# EasyEDA Pro project py32f002.eprj

# Schematic PY32F002ASOP20V1
Create Date: 2024-02-05; Page Name: P1; Project Name: py32f002; Schematic Name: PY32F002ASOP20V1; Update Date: 2024-05-11; Company: 嘉立创EDA; Page Size: A4; Version: V1.0
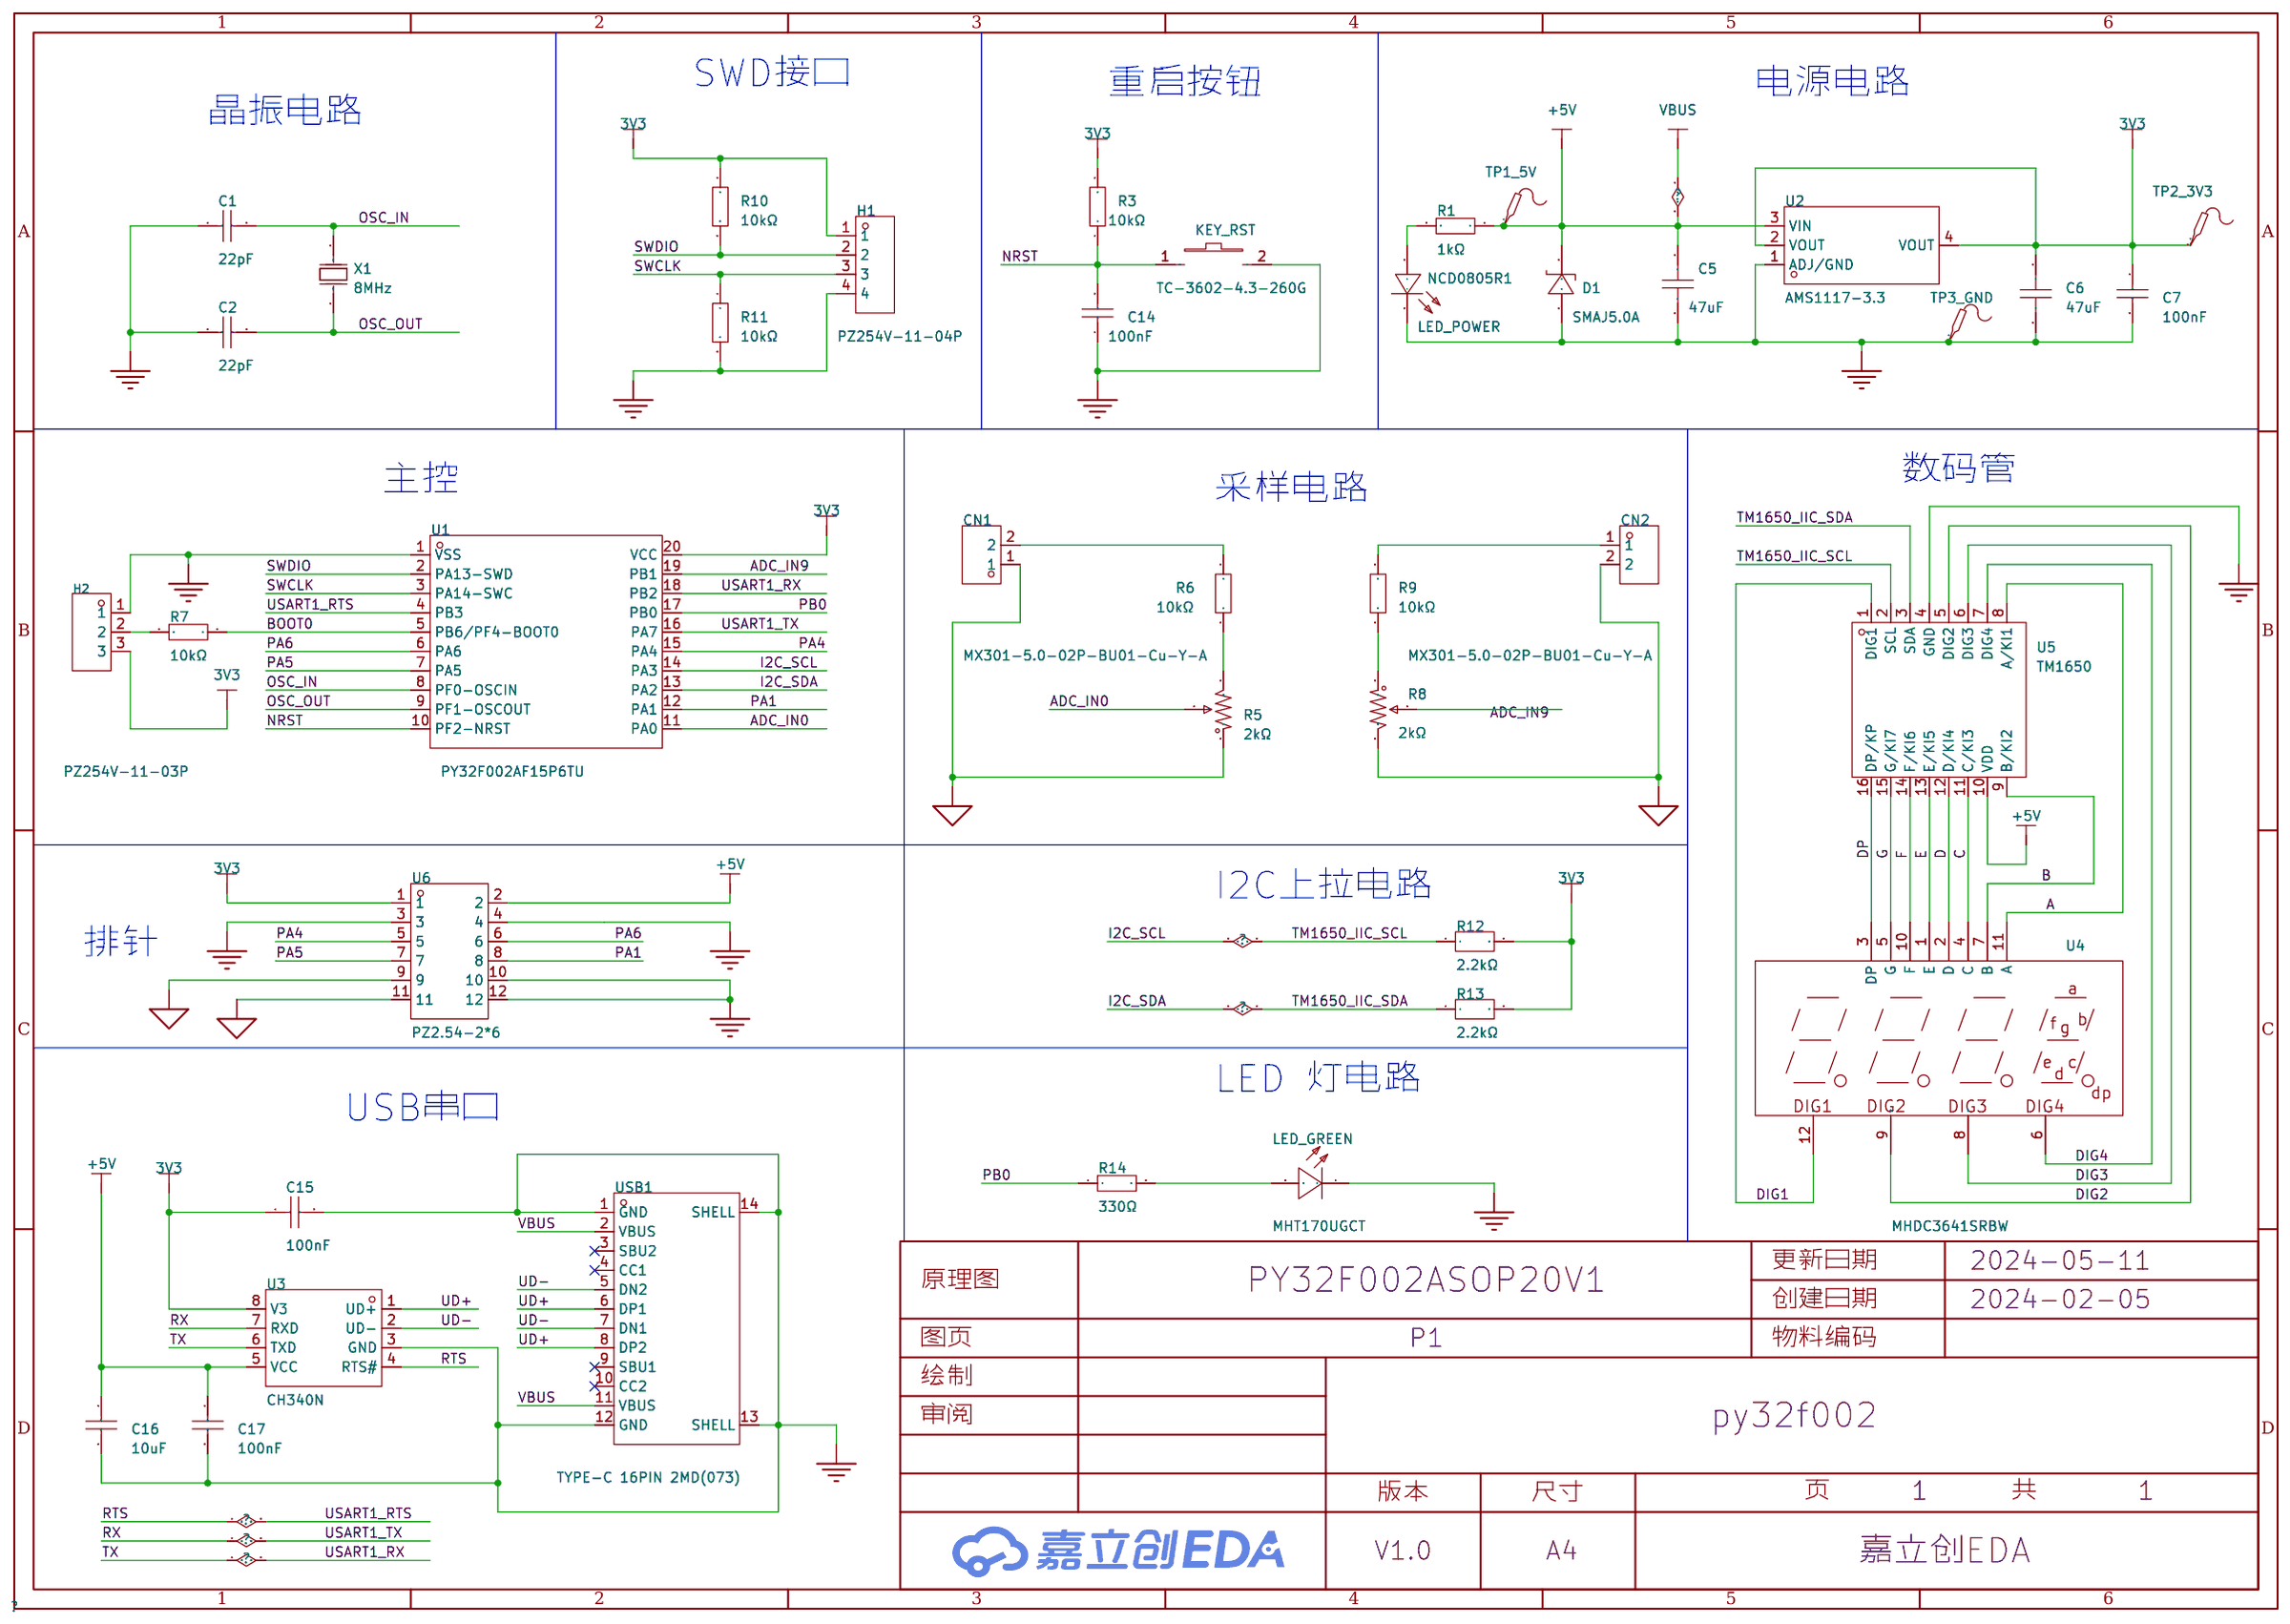
[diagram p0: schematic sheet]

## Parts
C1  22pF  [C0603]
C2  22pF  [C0603]
C5  47uF  [C1206]
C6  47uF  [C1206]
C7  100nF  [C1206]
C14  100nF  [C0603]
C15  100nF  [C1206]
C16  10uF  [C1206]
C17  100nF  [C1206]
CN1  MX301-5.0-02P-BU01-Cu-Y-A  [CONN-TH_2P-P5.0-MX301-5.0-02P-BU01-CU-Y-A]
CN2  MX301-5.0-02P-BU01-Cu-Y-A  [CONN-TH_2P-P5.0-MX301-5.0-02P-BU01-CU-Y-A]
D1  SMAJ5.0A  [SMA_L4.3-W2.6-LS5.2-RD]
H1  PZ254V-11-04P  [HDR-TH_4P-P2.54-V-M]
H2  PZ254V-11-03P  [HDR-TH_3P-P2.54-V-M]
KEY_RST  TC-3602-4.3-260G  [KEY-SMD_L6.0-W3.6-LS8.3-L]
LED_GREEN  MHT170UGCT  [LED0805-RD]
LED_POWER  NCD0805R1  [LED0805-R-RD]
R1  1kΩ  [R0603]
R3  10kΩ  [R0603]
R5  2kΩ  [RES-ADJ-SMD_3P-L3.8-W3.6_TC33X-2-502E]
R6  10kΩ  [R0603]
R7  10kΩ  [R0603]
R8  2kΩ  [RES-ADJ-SMD_3P-L3.8-W3.6_TC33X-2-502E]
R9  10kΩ  [R0603]
R10  10kΩ  [R0603]
R11  10kΩ  [R0603]
R12  2.2kΩ  [R0603]
R13  2.2kΩ  [R0603]
R14  330Ω  [R0603]
TP1_5V  -  [Test-Point-0.5mm]
TP2_3V3  -  [Test-Point-0.5mm]
TP3_GND  -  [Test-Point-0.5mm]
U1  PY32F002AF15P6TU  [TSSOP-20_L6.5-W4.4-P0.65-LS6.4-BL]
U2  AMS1117-3.3  [SOT-223_L6.5-W3.5-P2.30-LS7.0-BR]
U3  CH340N  [SOP-8_L4.9-W3.9-P1.27-LS6.0-BL]
U4  MHDC3641SRBW  [LED-SEG-TH_12P-L30.0-W14.0-P2.54-LS10.2]
U5  TM1650  [SOP-16_L10.0-W3.9-P1.27-LS6.0-BL]
U6  PZ2.54-2*6  [HDR-TH_12P-P2.54-V-M-R2-C6-S2.54_MOLEX]
USB1  TYPE-C 16PIN 2MD(073)  [USB-C-SMD_TYPE-C-6PIN-2MD-073]
X1  8MHz  [CRYSTAL-SMD_L11.5-W4.8-LS12.7]

## Library data of the parts
C1 C2 = CL10C220JB8NNNC: 容值:22pF;精度:±5%;额定电压:50V;材质(温度系数):C0G;; LCSC Part Name: 22pF ±5% 50V; Supplier Part: C1653; Manufacturer: SAMSUNG(三星); Supplier Footprint: 0603; JLCPCB Part Class: 基础库; Datasheet: https://atta.szlcsc.com/upload/public/pdf/source/20160218/1457707763339.pdf; Supplier: LCSC; Tolerance: ±5%; Voltage Rated: 50V; Temperature Coefficient: C0G
C5 C6 = GRM31CR61E476ME44L: 容值:47uF;精度:±20%;额定电压:25V;材质(温度系数):X5R;; LCSC Part Name: 47uF ±20% 25V; Supplier Part: C403725; Manufacturer: muRata(村田); Supplier Footprint: 1206; JLCPCB Part Class: 扩展库; Datasheet: https://atta.szlcsc.com/upload/public/pdf/source/20191025/C403725_B8A8CD2FFA1F57E6FDF268BD106459D5.pdf; Supplier: LCSC; Tolerance: ±20%; Voltage Rated: 25V; Temperature Coefficient: X5R
C7 C15 C17 = CL31B104KBCNNNC: 容值:100nF;精度:±10%;额定电压:50V;材质(温度系数):X7R;; LCSC Part Name: 100nF ±10% 50V; Supplier Part: C24497; Manufacturer: SAMSUNG(三星); Supplier Footprint: 1206; JLCPCB Part Class: 基础库; Datasheet: https://atta.szlcsc.com/upload/public/pdf/source/20160218/1457707763339.pdf; Supplier: LCSC; Tolerance: ±10%; Voltage Rated: 50V; Temperature Coefficient: X7R
C14 = 0603B104K500NT: 容值:100nF;精度:±10%;额定电压:50V;材质(温度系数):X7R;; LCSC Part Name: 100nF ±10% 50V; Supplier Part: C30926; Manufacturer: FH(风华); Supplier Footprint: 0603; JLCPCB Part Class: 扩展库; Datasheet: https://atta.szlcsc.com/upload/public/pdf/source/20200305/C486355_26A10D38EF8C2A5C37091D0039909270.pdf; Supplier: LCSC; Tolerance: ±10%; Voltage Rated: 50V; Temperature Coefficient: X7R
C16 = CL31A106KBHNNNE: 容值:10uF;精度:±10%;额定电压:50V;材质(温度系数):X5R;; LCSC Part Name: 10uF ±10% 50V; Supplier Part: C13585; Manufacturer: SAMSUNG(三星); Supplier Footprint: 1206; JLCPCB Part Class: 基础库; Datasheet: https://atta.szlcsc.com/upload/public/pdf/source/20160218/1457707763339.pdf; Supplier: LCSC; Tolerance: ±10%; Voltage Rated: 50V; Temperature Coefficient: X5R
CN1 CN2 = MX301-5.0-02P-BU01-Cu-Y-A: 结构:1x2P;间距:5mm;颜色:蓝色;安装方式:直插;额定电流:16A;额定电压:300V;排数:1;线规 - AWG:14~24;线规 - 平方毫米:1.5;每排PIN数:2;触头材质:铜合金;触头镀层:锡;工作温度范围:-40℃~+105℃;; LCSC Part Name: 5mm 1x2P 排数:1 每排P数:2 直插; Supplier Part: C5188422; Manufacturer: MAX(迈旭); Supplier Footprint: 插件,P=5mm; JLCPCB Part Class: Extended Part; Datasheet: https://atta.szlcsc.com/upload/public/pdf/source/20230915/1F0A484E8C4B07E7C9BE20D191F8A304.pdf; Supplier: LCSC; Structure: 1x2P; Pitch: 5mm; Color: 蓝色; Mounting Style: 直插; Current Rating (Max): 16A; Voltage Rating (Max): 300V; Number of Pins: 2P; Number of Rows: 1; Wire Gauge - AWG: 14~24; Wire Gauge - mm2: 1.5; Number of PINs Per Row: 2; Contact Material: 铜合金; Contact Plating: 锡; Operating Temperature Range: -40℃~+105℃
D1 = SMAJ5.0A_C10758: 反向截止电压(Vrwm):5V;最大钳位电压:9.2V;峰值脉冲电流(Ipp)@10/1000us:43.5A;击穿电压:6.4V;; LCSC Part Name: 单向TVS 5V截止 43.5A峰值脉冲; Supplier Part: C10758; Manufacturer: RUILON(瑞隆源); Supplier Footprint: SMA(DO-214AC); JLCPCB Part Class: 扩展库; Datasheet: https://atta.szlcsc.com/upload/public/pdf/source/20180711/C81281_95CC36DD15828E233F5FA92369DBC9C5.pdf; Supplier: LCSC; Reverse Stand-Off Voltage (Vrwm): 5V; Maximum Clamping Voltage: 9.2V; Peak Pulse Current (Ipp)@10/1000us: 43.5A; Breakdown Voltage: 6.4V; Type: TVS
H1 = PZ254V-11-04P: 插针结构:1x4P;间距:2.54mm;行距:-;圆针/方针:方针;安装类型:直插;排数:单排;总PIN位数:4P;额定电流:3A;额定电压:250V;配合针长度:6mm;塑高:2.5mm;端接针长度:3mm;触头材质:-;工作温度范围:-40℃~+105℃;颜色:黑色;; LCSC Part Name: 间距:2.54mm 1x4P 直插 方针; Supplier Part: C2691448; Manufacturer: XFCN(兴飞); Supplier Footprint: 插件,P=2.54mm; JLCPCB Part Class: 扩展库; Datasheet: https://atta.szlcsc.com/upload/public/pdf/source/20200309/C492403_F9F19131791D08044AD4F84F8E751A34.pdf; Supplier: LCSC; Pin Structure: 1x4P; Pitch: 2.54mm; Circluar Pins/Square Pins: 方针; Mounting Type: 直插; Number of Rows: 单排; Number of Pins: 4P; Current Rating (Max): 3A; Voltage Rating (Max): 250V; Length of Mating Pin: 6mm; Insulation Height: 2.5mm; Length of End Connection Pin: 3mm; Operating Temperature Range: -40℃~+105℃; Color: 黑色
H2 = PZ254V-11-03P: 插针结构:1x3P;间距:2.54mm;行距:-;圆针/方针:方针;安装类型:直插;排数:单排;总PIN位数:3P;额定电流:3A;额定电压:250V;配合针长度:6mm;塑高:2.5mm;端接针长度:3mm;工作温度范围:-40℃~+105℃;颜色:黑色;; LCSC Part Name: 间距:2.54mm 1x3P 直插 方针; Supplier Part: C2937625; Manufacturer: XFCN(兴飞); Supplier Footprint: 插件,P=2.54mm; JLCPCB Part Class: 扩展库; Datasheet: https://atta.szlcsc.com/upload/public/pdf/source/20200309/C492402_8335C3D49C4E4C618838D59BB1D024C1.pdf; Supplier: LCSC; Pin Structure: 1x3P; Pitch: 2.54mm; Circluar Pins/Square Pins: 方针; Mounting Type: 直插; Number of Rows: 单排; Number of Pins: 3P; Current Rating (Max): 3A; Voltage Rating (Max): 250V; Length of Mating Pin: 6mm; Insulation Height: 2.5mm; Length of End Connection Pin: 3mm; Operating Temperature Range: -40℃~+105℃; Color: 黑色
KEY_RST = TC-3602-4.3-260G_C3012022: 电路结构:单刀单掷;带支架:否;触点电流:50mA;额定电压(AC):-;额定电压(DC):12V;额定功率:-;安装方式:立贴;绝缘电阻:-;带灯:无;作用力:260gf;机械寿命:10万次;; LCSC Part Name: 3*6*4.3mm 立贴 轻触开关; Supplier Part: C3012022; Manufacturer: HCTL(华灿天禄); Supplier Footprint: SMD; JLCPCB Part Class: 扩展库; Datasheet: https://atta.szlcsc.com/upload/public/pdf/source/20210730/C2845293_5277CDF8C59032B794BE536E6FDEACDD.pdf; Supplier: LCSC; Circuit: 单刀单掷; Actuator Style: 圆形按钮; Switch Length: 3mm; Switch Width: 6mm; Switch Height: 4.3mm; Strike Gundam: 否; Contact Current: 50mA; Voltage Rating (DC): 12V; Mounting Style: 立贴; Actuator/Cap Color: 白色; With Lamp: 无; Operating Force: 260gf; Mechanical Life: 10万次; Operating Temperature: -30℃~+85℃
LED_GREEN = MHT170UGCT: 发光颜色:翠绿色;功率:95mW;正向电流:20mA;主波长:517.5nm~527.5nm;二极管配置:-;透镜颜色:无色透明透镜;色温:-;发光角度:140°;载带方式:-;工作温度:-40℃~+85℃;; LCSC Part Name: 翠绿; Supplier Part: C397047; Manufacturer: MEIHUA(美华); Supplier Footprint: 0805; JLCPCB Part Class: 扩展库; Datasheet: https://atta.szlcsc.com/upload/public/pdf/source/20190613/C397047_2A22FA6439BE28969F43FCCFADF75FF7.pdf; Supplier: LCSC; Emitted Color: 翠绿色; Power Dissipation: 95mW; Forward Current: 20mA; Dominant Wavelength: 517.5nm~527.5nm; Peak Wavelength: 518nm; Lens Color: 无色透明透镜; Viewing Angle: 140°; Operating Temperature: -40℃~+85℃
LED_POWER = NCD0805R1: 灯头类型:-;发光颜色:红色;正向电压(VF):1.6V~2.6V;功率:65mW;正向电流:20mA;主波长:615nm~630nm;二极管配置:独立二极管;透镜颜色:无色透明;色温:-;发光强度:67mcd~195mcd;发光角度:130°;载带方式:-;工作温度:-30℃~+85℃;; Supplier Part: C84256; Manufacturer: 国星光电; Supplier Footprint: 0805; JLCPCB Part Class: 基础库; Datasheet: https://atta.szlcsc.com/upload/public/pdf/source/20200820/C84256_F0A75A43B3EAD75808600A0514C76B99.pdf; Supplier: LCSC; Emitted Color: 红色; Forward Voltage (VF): 1.6V~2.6V; Power Dissipation: 65mW; Forward Current: 20mA; Dominant Wavelength: 615nm~630nm; Diode Configuration: 独立二极管; Lens Color: 无色透明; Luminous Intensity: 67mcd~195mcd; Viewing Angle: 130°; Operating Temperature: -30℃~+85℃
R1 = RC0603FR-071KL: 电阻类型:厚膜电阻;阻值:1kΩ;精度:±1%;功率:100mW;; LCSC Part Name: 1kΩ ±1% 100mW; Supplier Part: C22548; Manufacturer: YAGEO(国巨); Supplier Footprint: 0603; JLCPCB Part Class: 扩展库; Datasheet: https://atta.szlcsc.com/upload/public/pdf/source/20180312/7BD3618A8B6324EA6280B0497A051AB7.pdf; Supplier: LCSC; Type: 厚膜电阻; Tolerance: ±1%; Power(Watts): 100mW; Temperature Coefficient: ±100ppm/℃; Overload Voltage (Max): 75V; Operating Temperature Range: -55℃~+155℃
R3 R6 R7 R9-R11 = 0603WAF1002T5E: 电阻类型:厚膜电阻;阻值:10kΩ;精度:±1%;功率:100mW;最大工作电压:75V;温度系数:±100ppm/℃;; LCSC Part Name: 10kΩ ±1% 100mW 厚膜电阻; Supplier Part: C25804; Manufacturer: UNI-ROYAL(厚声); Supplier Footprint: 0603; JLCPCB Part Class: 基础库; Datasheet: https://atta.szlcsc.com/upload/public/pdf/source/20200306/C422600_1E6D84923E4A46A82E41ADD87F860B5C.pdf; Supplier: LCSC; Type: 厚膜电阻; Tolerance: ±1%; Power(Watts): 100mW; Overload Voltage (Max): 75V; Temperature Coefficient: ±100ppm/℃; Operating Temperature Range: -55℃~+155℃
R5 R8 = TC33X-2-202E: 阻值:2kΩ;精度:±25%;功率:150mW;温度系数:±250ppm/℃;; LCSC Part Name: 2kΩ ±25%; Supplier Part: C720647; Manufacturer: BOURNS; Supplier Footprint: SMD; JLCPCB Part Class: 扩展库; Datasheet: https://atta.szlcsc.com/upload/public/pdf/source/20200810/C720646_BB66A75E654D5E1D30127FF45BCD3C26.pdf; Supplier: LCSC; Tolerance: ±25%; Power(Watts): 150mW; Temperature Coefficient: ±250ppm/℃; Turns: 1
R12 R13 = FRC0603J222 TS: 电阻类型:厚膜电阻;阻值:2.2kΩ;精度:±5%;功率:100mW;最大工作电压:75V;温度系数:±100ppm/℃;; LCSC Part Name: 2.2kΩ ±5% 100mW 厚膜电阻; Supplier Part: C2907117; Manufacturer: FOJAN(富捷); Supplier Footprint: 0603; JLCPCB Part Class: 扩展库; Datasheet: https://atta.szlcsc.com/upload/public/pdf/source/20211221/925EC7D7225764EE0046F22065062C87.pdf; Supplier: LCSC; Type: 厚膜电阻; Tolerance: ±5%; Power(Watts): 100mW; Overload Voltage (Max): 75V; Temperature Coefficient: ±100ppm/℃; Operating Temperature Range: -55℃~+155℃
R14 = 0603WAF3300T5E: 电阻类型:厚膜电阻;阻值:330Ω;精度:±1%;功率:100mW;最大工作电压:75V;温度系数:±100ppm/℃;; LCSC Part Name: 330Ω ±1% 100mW 厚膜电阻; Supplier Part: C23138; Manufacturer: UNI-ROYAL(厚声); Supplier Footprint: 0603; JLCPCB Part Class: 基础库; Datasheet: https://atta.szlcsc.com/upload/public/pdf/source/20200306/C422600_1E6D84923E4A46A82E41ADD87F860B5C.pdf; Supplier: LCSC; Type: 厚膜电阻; Tolerance: ±1%; Power(Watts): 100mW; Overload Voltage (Max): 75V; Temperature Coefficient: ±100ppm/℃; Operating Temperature Range: -55℃~+155℃
TP1_5V TP2_3V3 TP3_GND = Test-Point: Test Point 测试点
U1 = PY32F002AF15P6TU: 程序存储容量:20KB;RAM总容量:3KB;工作电压范围:1.7V~5.5V;CPU最大主频:24MHz;程序存储器类型:FLASH;; LCSC Part Name: 32位微控制器 单片机  PY32F002AF15P6TU; Supplier Part: C5292059; Manufacturer: PUYA(普冉); Supplier Footprint: TSSOP-20; JLCPCB Part Class: 扩展库; Datasheet: https://atta.szlcsc.com/upload/public/pdf/source/20230327/672347329C675A87241B0153A51AEBC2.pdf; Supplier: LCSC; Program Storage Size: 20KB; RAM Size: 3KB; Operating Voltage Range: 1.7V~5.5V; CPU Maximum Speed: 24MHz; Program Memory Type: FLASH; ADC (Bit): 12bit
U2 = AMS1117-3.3_C426566: 输出类型:固定;最大输入电压:18V;输出电压:3.3V;输出电流:1A;电源纹波抑制比(PSRR):70dB@(120Hz);输出极性:正;; LCSC Part Name: 输入18V 输出3.3V 1A; Supplier Part: C426566; Manufacturer: Slkor(萨科微); Supplier Footprint: SOT-223; JLCPCB Part Class: 扩展库; Datasheet: https://atta.szlcsc.com/upload/public/pdf/source/20201231/C426566_7F22DB93439D00F3FA27143E4F28C6AA.pdf; Supplier: LCSC; Output Type: 固定; Maximum Input Voltage: 18V; Output Voltage: 3.3V; Output Current: 1A; Power Supply Rejection Ratio (PSRR): 70dB@(120Hz); Dropout Voltage: 1.4V@(1A); Output Polarity: 正; Number of Outputs: 1
U3 = CH340N: LCSC Part Name: USB转串口芯片 CH340; Supplier Part: C2977777; Manufacturer: WCH(南京沁恒); Supplier Footprint: SOP-8; JLCPCB Part Class: 扩展库; Datasheet: https://atta.szlcsc.com/upload/public/pdf/source/20230530/6E401E9554E9F5311886CC8B3F89B62E.pdf; Supplier: LCSC
U4 = MHDC3641SRBW: 数码管位数:4位;功耗:50mW;发光颜色:红色;LED极性:共阴极;数字/字母大小(英寸):0.362;; LCSC Part Name: 0.36共阴四八红色数码管; Supplier Part: C3291494; Manufacturer: MEIHUA(美华); Supplier Footprint: 插件; JLCPCB Part Class: 扩展库; Datasheet: https://atta.szlcsc.com/upload/public/pdf/source/20220627/BF0C2CD628B0CAC5A0500BAA2D144DD2.pdf; Supplier: LCSC; Number of Characters: 4位; Module Size: 30.0mmx14mmx7.2mm; Power Dissipation: 50mW; Luminous Color: 红色; LED Polarity: 共阴极; Digit/Alpha Size(inch): 0.362
U5 = TM1650: 晶圆版本是TA1809B; LCSC Part Name: 晶圆版本是TA1809B; Supplier Part: C2685241; Manufacturer: TM(天微); Supplier Footprint: SOP-16; JLCPCB Part Class: 扩展库; Datasheet: https://atta.szlcsc.com/upload/public/pdf/source/20210512/C2685241_0A1DB6924EEA12E8A785A705958A55DE.pdf; Supplier: LCSC
U6 = PZ2.54-2*6: 插针结构:2x6P;间距:2.54mm;安装类型:直插;排数:双排;总PIN位数:12P;触头镀层:金;; Supplier Part: C5224012; Manufacturer: ZHOURI(洲日); Supplier Footprint: 插件,P=2.54mm; JLCPCB Part Class: 扩展库; Datasheet: https://atta.szlcsc.com/upload/public/pdf/source/20221102/F6E64F82A31FDA60716E030A65DD5F03.pdf; Supplier: LCSC; Pin Structure: 2x6P; Pitch: 2.54mm; Mounting Type: 直插; Number of Rows: 双排; Number of Pins: 12P; Contact Plating: 金
USB1 = TYPE-C 16PIN 2MD(073): 连接器类型:Type-C;标准:-;公母:母;端口数量:1;触点数量:16P;安装方式:卧贴;额定电流 - 电源:5A;工作温度范围:-25℃~+85℃;; LCSC Part Name: Type-C 母 卧贴; Supplier Part: C2765186; Manufacturer: SHOU HAN(首韩); Supplier Footprint: SMD; JLCPCB Part Class: 扩展库; Datasheet: https://atta.szlcsc.com/upload/public/pdf/source/20211123/39B17C16241EAC15C5E277BDA434118E.pdf; Supplier: LCSC; Connector Type: Type-C; Gender: 母; Number of Ports: 1; Number of Contacts: 16P; Mounting Style: 卧贴; Current Rating - Power (Max): 5A; Operating Temperature Range: -25℃~+85℃
X1 = X49SM8MSD2SC: 晶振类型:贴片晶振;频率:8MHz;常温频差:±20ppm;外接负载电容:20pF;频率稳定度(全温):±30ppm;; LCSC Part Name: 8MHz ±20ppm 20pF; Supplier Part: C12674; Manufacturer: YXC(扬兴晶振); Supplier Footprint: HC-49S-SMD; JLCPCB Part Class: 基础库; Datasheet: https://atta.szlcsc.com/upload/public/pdf/source/20210329/C106809_0E91E60850A780B284B63D653DC40EA4.pdf; Supplier: LCSC; Crystal Type: 贴片晶振; Normal temperature Frequency Tolerance: ±20ppm; External load capacitor: 20pF; Frequency Stability(Full temperature range): ±30ppm; Operating Temperature: -20℃~+70℃

## Nets
3V3: C6.1 C7.1 C15.1 H1.1 H2.3 R3.2 R10.1 R12.2 R13.2 TP2_3V3.1 U1.20(VCC) U2.2(VOUT) U2.4(VOUT) U3.8(V3) U6.1
+5V: C5.1 C16.1 C17.1 D1.1(K) R1.1 TP1_5V.1 U2.3(VIN) U3.5(VCC) U5.10(VDD) U6.2 USB1.2(VBUS) USB1.11(VBUS)
AGND1: CN1.1 R5.1 U6.9
AGND2: CN2.2 R8.3 U6.11
GND: C1.1 C2.1 C5.2 C6.2 C7.2 C14.1 C15.2 C16.2 C17.2 D1.2(A) H1.4 H2.1 KEY_RST.2 LED_GREEN.1(K) LED_POWER.2(-) R11.2 TP3_GND.1 U1.1(VSS) U2.1(ADJ/GND) U3.3(GND) U5.4(GND) U6.3 U6.4 U6.10 U6.12 USB1.1(GND) USB1.12(GND) USB1.13(SHELL) USB1.14(SHELL)
A: U4.11(A) U5.8(A/KI1)
ADC_IN0: R5.2 U1.11(PA0)
ADC_IN9: R8.2 U1.19(PB1)
B: U4.7(B) U5.9(B/KI2)
BOOT0: R7.1 U1.5(PB6/PF4-BOOT0)
C: U4.4(C) U5.11(C/KI3)
D: U4.2(D) U5.12(D/KI4)
DIG1: U4.12(DIG1) U5.1(DIG1)
DIG2: U4.9(DIG2) U5.5(DIG2)
DIG3: U4.8(DIG3) U5.6(DIG3)
DIG4: U4.6(DIG4) U5.7(DIG4)
DP: U4.3(DP) U5.16(DP/KP)
E: U4.1(E) U5.13(E/KI5)
F: U4.10(F) U5.14(F/KI6)
G: U4.5(G) U5.15(G/KI7)
I2C_SCL: R12.1 U1.14(PA3) U5.2(SCL)
I2C_SDA: R13.1 U1.13(PA2) U5.3(SDA)
NRST: C14.2 KEY_RST.1 R3.1 U1.10(PF2-NRST)
OSC_IN: C1.2 U1.8(PF0-OSCIN) X1.2(OSC2)
OSC_OUT: C2.2 U1.9(PF1-OSCOUT) X1.1(OSC1)
PA1: U1.12(PA1) U6.8
PA4: U1.15(PA4) U6.5
PA5: U1.7(PA5) U6.7
PA6: U1.6(PA6) U6.6
PB0: R14.1 U1.17(PB0)
RTS: U1.4(PB3) U3.4(RTS#)
RX: U1.16(PA7) U3.7(RXD)
SWCLK: H1.3 R11.1 U1.3(PA14-SWC)
SWDIO: H1.2 R10.2 U1.2(PA13-SWD)
TX: U1.18(PB2) U3.6(TXD)
UD+: U3.1(UD+) USB1.6(DP1) USB1.8(DP2)
UD-: U3.2(UD-) USB1.5(DN2) USB1.7(DN1)
$1N1634: LED_POWER.1(+) R1.2
$1N8558: H2.2 R7.2
$1N8622: R8.1 R9.1
$1N8806: CN2.1 R9.2
$1N8861: CN1.2 R6.2
$1N9077: LED_GREEN.2(A) R14.2
$1N9272: R5.3 R6.1

Not connected (* = marked no-connect by the designer): USB1 3(SBU2)* 4(CC1)* 9(SBU1)* 10(CC2)*

## Notes on the sheet
- SWD接口
- 重启按钮
- 电源电路
- 晶振电路
- 主控
- 数码管
- 采样电路
- I2C上拉电路
- 排针
- LED 灯电路
- USB串口

# Schematic PY32F002ATSSOP8V1
Create Date: 2024-02-07; Page Name: P1; Project Name: py32f002; Schematic Name: PY32F002ATSSOP8V1; Update Date: 2024-02-28; Company: 嘉立创EDA; Page Size: A4; Version: V1.0
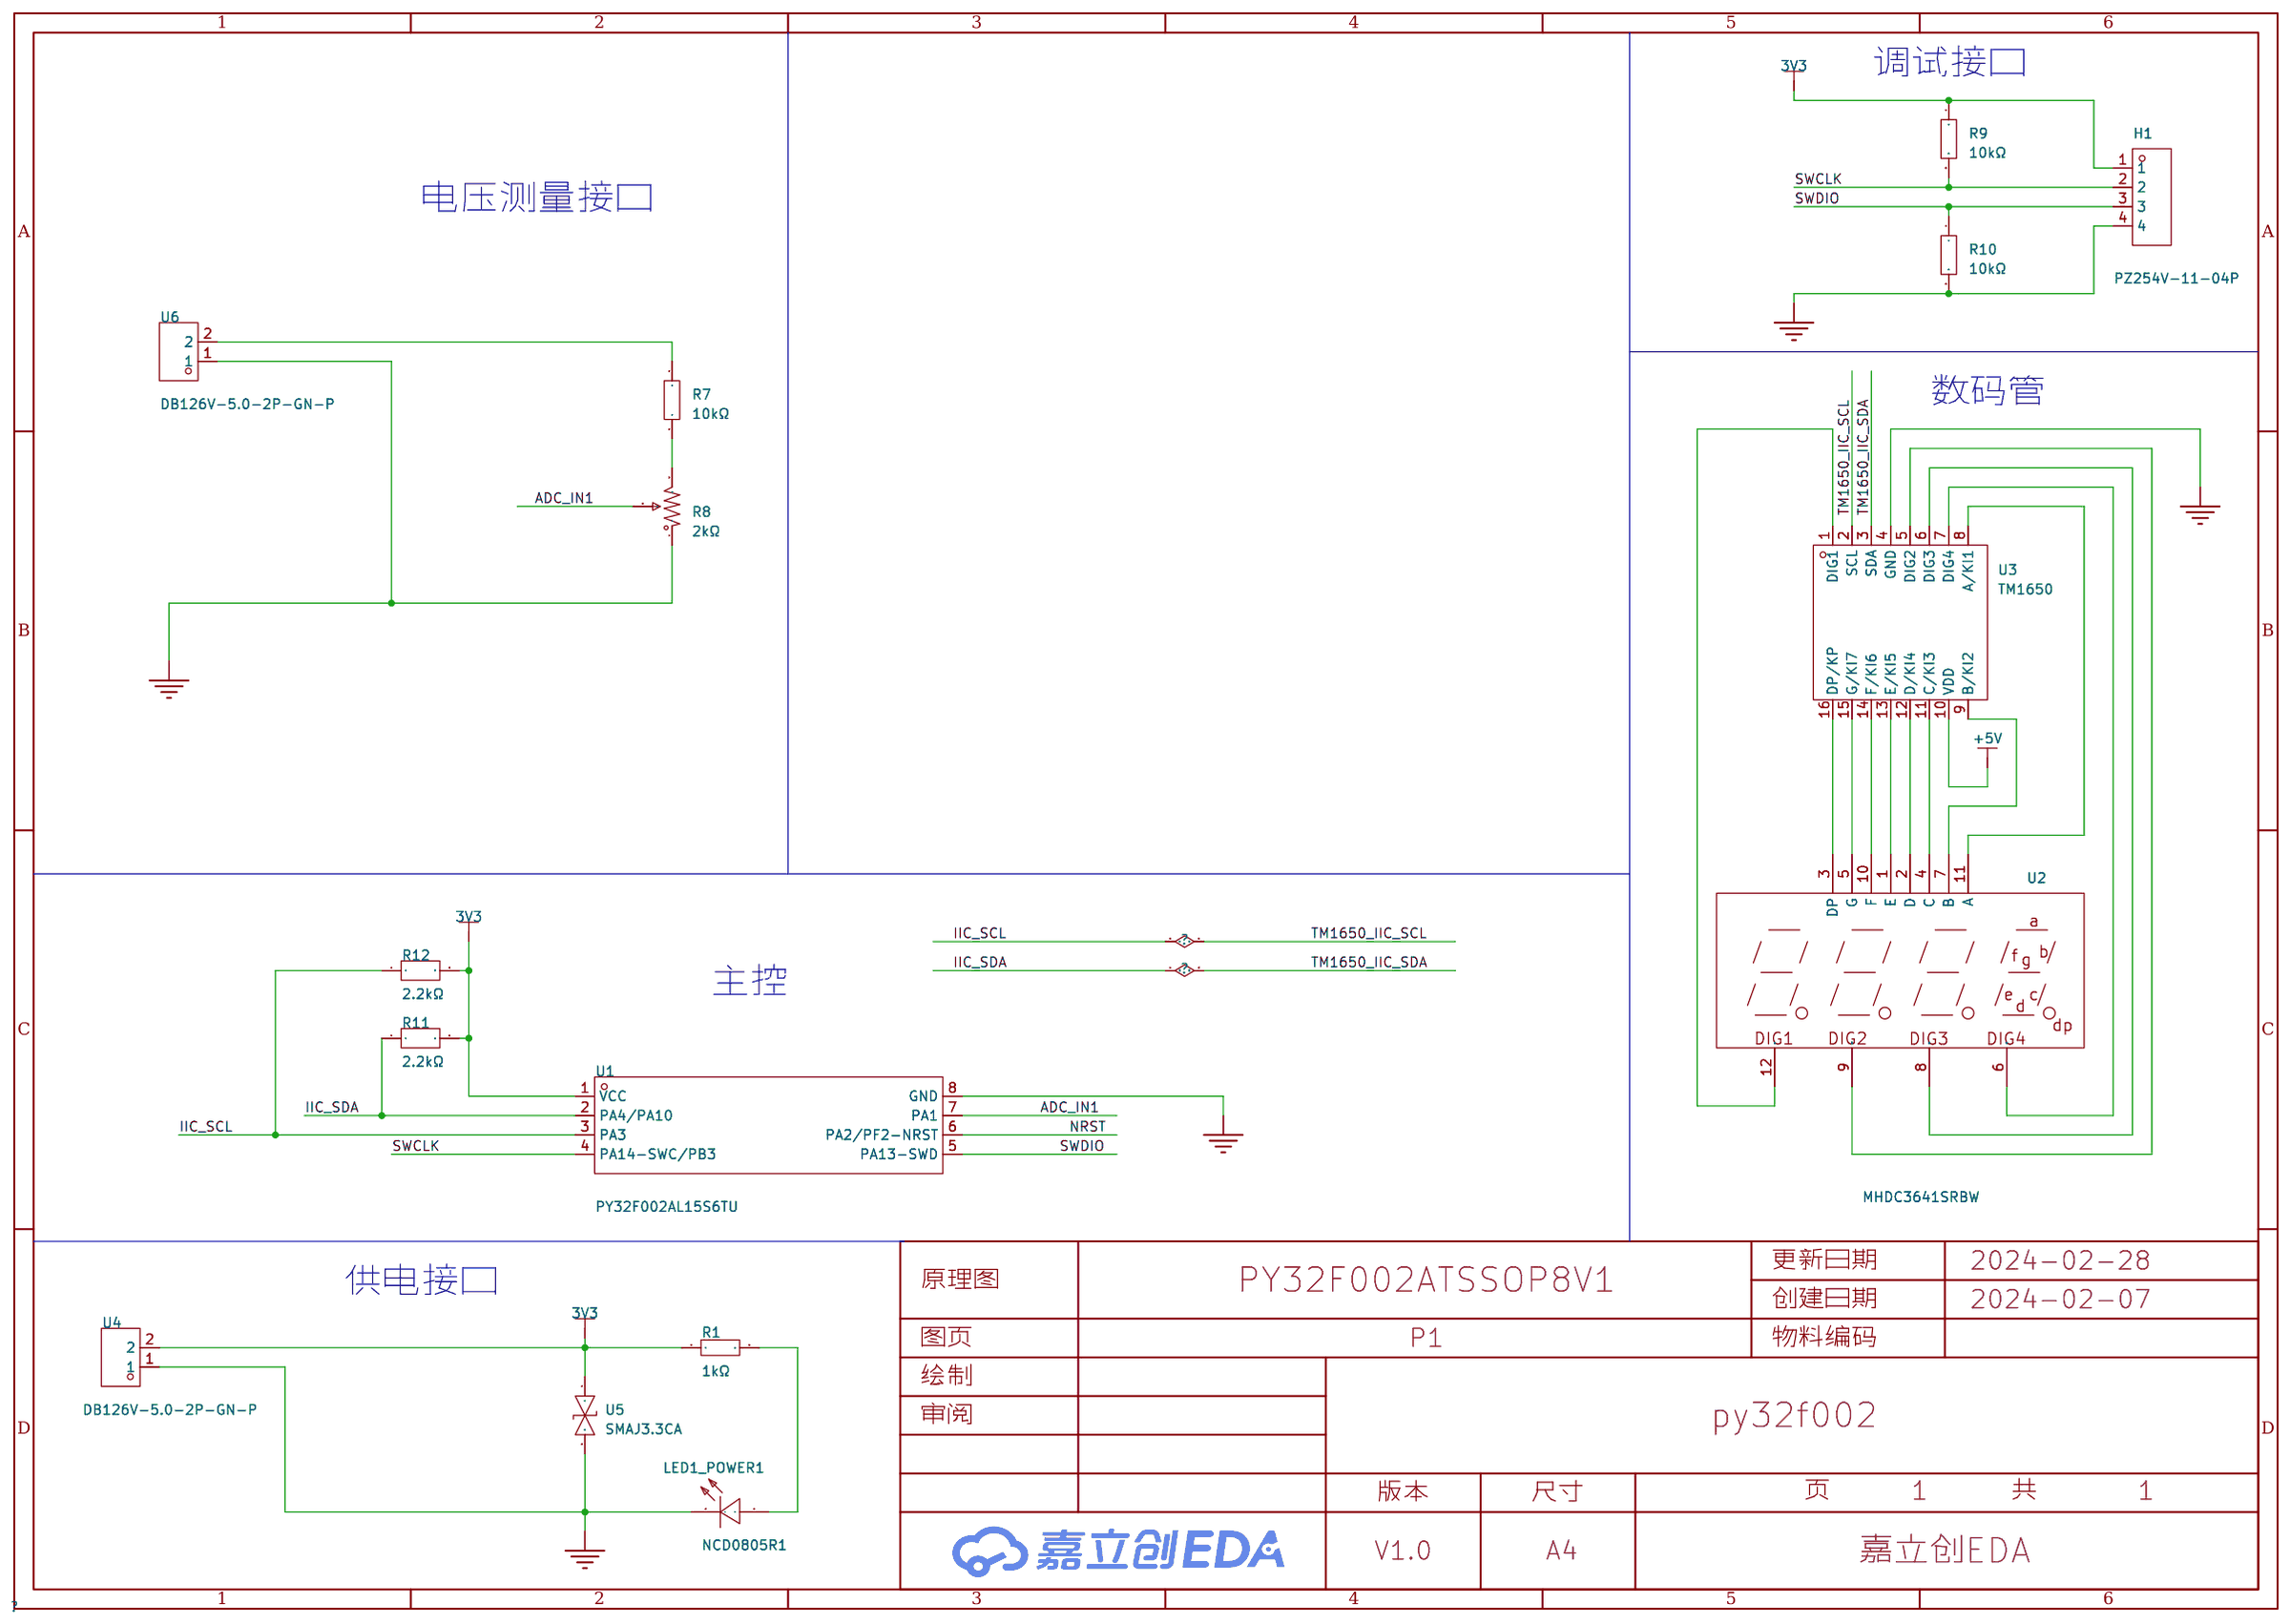
[diagram p1: schematic sheet]

## Parts
H1  PZ254V-11-04P  [HDR-TH_4P-P2.54-V-M]
LED1_POWER1  NCD0805R1  [LED0805-R-RD]
R1  1kΩ  [R0603]
R7  10kΩ  [R0603]
R8  2kΩ  [RES-ADJ-SMD_3P-L3.8-W3.6_TC33X-2-502E]
R9  10kΩ  [R0603]
R10  10kΩ  [R0603]
R11  2.2kΩ  [R0603]
R12  2.2kΩ  [R0603]
U1  PY32F002AL15S6TU  [SOP-8_L4.9-W3.9-P1.27-LS6.0-BL-1]
U2  MHDC3641SRBW  [LED-SEG-TH_12P-L30.0-W14.0-P2.54-LS10.2]
U3  TM1650  [SOP-16_L10.0-W3.9-P1.27-LS6.0-BL]
U4  DB126V-5.0-2P-GN-P  [CONN-TH_2P-P5.00_L7.8-W10.0]
U5  SMAJ3.3CA  [SMA_L4.4-W2.6-LS5.0-BI]
U6  DB126V-5.0-2P-GN-P  [CONN-TH_2P-P5.00_L7.8-W10.0]

## Library data of the parts
H1 = PZ254V-11-04P: 插针结构:1x4P;间距:2.54mm;行距:-;圆针/方针:方针;安装类型:直插;排数:单排;总PIN位数:4P;额定电流:3A;额定电压:250V;配合针长度:6mm;塑高:2.5mm;端接针长度:3mm;触头材质:-;工作温度范围:-40℃~+105℃;颜色:黑色;; LCSC Part Name: 间距:2.54mm 1x4P 直插 方针; Supplier Part: C2691448; Manufacturer: XFCN(兴飞); Supplier Footprint: 插件,P=2.54mm; JLCPCB Part Class: 扩展库; Datasheet: https://atta.szlcsc.com/upload/public/pdf/source/20200309/C492403_F9F19131791D08044AD4F84F8E751A34.pdf; Supplier: LCSC; Pin Structure: 1x4P; Pitch: 2.54mm; Circluar Pins/Square Pins: 方针; Mounting Type: 直插; Number of Rows: 单排; Number of Pins: 4P; Current Rating (Max): 3A; Voltage Rating (Max): 250V; Length of Mating Pin: 6mm; Insulation Height: 2.5mm; Length of End Connection Pin: 3mm; Operating Temperature Range: -40℃~+105℃; Color: 黑色
LED1_POWER1 = NCD0805R1: 灯头类型:-;发光颜色:红色;正向电压(VF):1.6V~2.6V;功率:65mW;正向电流:20mA;主波长:615nm~630nm;二极管配置:独立二极管;透镜颜色:无色透明;色温:-;发光强度:67mcd~195mcd;发光角度:130°;载带方式:-;工作温度:-30℃~+85℃;; Supplier Part: C84256; Manufacturer: 国星光电; Supplier Footprint: 0805; JLCPCB Part Class: 基础库; Datasheet: https://atta.szlcsc.com/upload/public/pdf/source/20200820/C84256_F0A75A43B3EAD75808600A0514C76B99.pdf; Supplier: LCSC; Emitted Color: 红色; Forward Voltage (VF): 1.6V~2.6V; Power Dissipation: 65mW; Forward Current: 20mA; Dominant Wavelength: 615nm~630nm; Diode Configuration: 独立二极管; Lens Color: 无色透明; Luminous Intensity: 67mcd~195mcd; Viewing Angle: 130°; Operating Temperature: -30℃~+85℃
R1 = RC0603FR-071KL: 电阻类型:厚膜电阻;阻值:1kΩ;精度:±1%;功率:100mW;; LCSC Part Name: 1kΩ ±1% 100mW; Supplier Part: C22548; Manufacturer: YAGEO(国巨); Supplier Footprint: 0603; JLCPCB Part Class: 扩展库; Datasheet: https://atta.szlcsc.com/upload/public/pdf/source/20180312/7BD3618A8B6324EA6280B0497A051AB7.pdf; Supplier: LCSC; Type: 厚膜电阻; Tolerance: ±1%; Power(Watts): 100mW; Temperature Coefficient: ±100ppm/℃; Overload Voltage (Max): 75V; Operating Temperature Range: -55℃~+155℃
R7 = 0603WAF1002T5E: 电阻类型:厚膜电阻;阻值:10kΩ;精度:±1%;功率:100mW;; LCSC Part Name: 厚膜电阻 10kΩ ±1% 100mW; Supplier Part: C25804; Manufacturer: UNI-ROYAL(厚声); Supplier Footprint: 0603; JLCPCB Part Class: 基础库; Datasheet: https://atta.szlcsc.com/upload/public/pdf/source/20200306/C422600_1E6D84923E4A46A82E41ADD87F860B5C.pdf; Supplier: LCSC; Type: 厚膜电阻; Tolerance: ±1%; Power(Watts): 100mW; Overload Voltage (Max): 75V; Temperature Coefficient: ±100ppm/℃; Operating Temperature Range: -55℃~+155℃
R8 = TC33X-2-202E: 阻值:2kΩ;精度:±25%;功率:150mW;温度系数:±250ppm/℃;; LCSC Part Name: 2kΩ ±25%; Supplier Part: C720647; Manufacturer: BOURNS; Supplier Footprint: SMD; JLCPCB Part Class: 扩展库; Datasheet: https://atta.szlcsc.com/upload/public/pdf/source/20200810/C720646_BB66A75E654D5E1D30127FF45BCD3C26.pdf; Supplier: LCSC; Tolerance: ±25%; Power(Watts): 150mW; Temperature Coefficient: ±250ppm/℃; Turns: 1
R9 R10 = 0603WAF1002T5E: 电阻类型:厚膜电阻;阻值:10kΩ;精度:±1%;功率:100mW;最大工作电压:75V;温度系数:±100ppm/℃;; LCSC Part Name: 10kΩ ±1% 100mW 厚膜电阻; Supplier Part: C25804; Manufacturer: UNI-ROYAL(厚声); Supplier Footprint: 0603; JLCPCB Part Class: 基础库; Datasheet: https://atta.szlcsc.com/upload/public/pdf/source/20200306/C422600_1E6D84923E4A46A82E41ADD87F860B5C.pdf; Supplier: LCSC; Type: 厚膜电阻; Tolerance: ±1%; Power(Watts): 100mW; Overload Voltage (Max): 75V; Temperature Coefficient: ±100ppm/℃; Operating Temperature Range: -55℃~+155℃
R11 R12 = FRC0603J222 TS: 电阻类型:厚膜电阻;阻值:2.2kΩ;精度:±5%;功率:100mW;最大工作电压:75V;温度系数:±100ppm/℃;; LCSC Part Name: 2.2kΩ ±5% 100mW 厚膜电阻; Supplier Part: C2907117; Manufacturer: FOJAN(富捷); Supplier Footprint: 0603; JLCPCB Part Class: 扩展库; Datasheet: https://atta.szlcsc.com/upload/public/pdf/source/20211221/925EC7D7225764EE0046F22065062C87.pdf; Supplier: LCSC; Type: 厚膜电阻; Tolerance: ±5%; Power(Watts): 100mW; Overload Voltage (Max): 75V; Temperature Coefficient: ±100ppm/℃; Operating Temperature Range: -55℃~+155℃
U1 = PY32F002AL15S6TU: 程序存储容量:20KB;RAM总容量:3KB;工作电压范围:1.7V~5.5V;CPU最大主频:24MHz;程序存储器类型:FLASH;; LCSC Part Name: 32位微控制器 单片机 PY32F002AL15S6TU; Supplier Part: C5292060; Manufacturer: PUYA(普冉); Supplier Footprint: SOP-8; JLCPCB Part Class: 扩展库; Datasheet: https://atta.szlcsc.com/upload/public/pdf/source/20230327/672347329C675A87241B0153A51AEBC2.pdf; Supplier: LCSC; Program Storage Size: 20KB; RAM Size: 3KB; Operating Voltage Range: 1.7V~5.5V; CPU Maximum Speed: 24MHz; Program Memory Type: FLASH; ADC (Bit): 12bit
U2 = MHDC3641SRBW: 数码管位数:4位;功耗:50mW;发光颜色:红色;LED极性:共阴极;数字/字母大小(英寸):0.362;; LCSC Part Name: 0.36共阴四八红色数码管; Supplier Part: C3291494; Manufacturer: MEIHUA(美华); Supplier Footprint: 插件; JLCPCB Part Class: 扩展库; Datasheet: https://atta.szlcsc.com/upload/public/pdf/source/20220627/BF0C2CD628B0CAC5A0500BAA2D144DD2.pdf; Supplier: LCSC; Number of Characters: 4位; Module Size: 30.0mmx14mmx7.2mm; Power Dissipation: 50mW; Luminous Color: 红色; LED Polarity: 共阴极; Digit/Alpha Size(inch): 0.362
U3 = TM1650: 晶圆版本是TA1809B; LCSC Part Name: 晶圆版本是TA1809B; Supplier Part: C2685241; Manufacturer: TM(天微); Supplier Footprint: SOP-16; JLCPCB Part Class: 扩展库; Datasheet: https://atta.szlcsc.com/upload/public/pdf/source/20210512/C2685241_0A1DB6924EEA12E8A785A705958A55DE.pdf; Supplier: LCSC
U4 U6 = DB126V-5.0-2P-GN-P: 间距:5mm;结构:1x2P;排数:1;每排PIN数:2;安装方式:直插;额定电流:15A;额定电压:250V;线规 - AWG:14~26;线规 - mm2:1.5;工作温度范围:-40℃~+105℃;颜色:绿色;; LCSC Part Name: 5mm 1x2P 排数:1 每排P数:2 直插; Supplier Part: C395849; Manufacturer: DIBO(地博电气); Supplier Footprint: 插件,P=5mm; JLCPCB Part Class: 扩展库; Datasheet: https://atta.szlcsc.com/upload/public/pdf/source/20230406/A033F46F5FECA00BC1B8D9A3F749A51C.pdf; Supplier: LCSC; Pitch: 5mm; Structure: 1x2P; Number of Rows: 1; Number of PINs Per Row: 2; Mounting Style: 直插; Current Rating (Max): 15A; Voltage Rating (Max): 250V; Wire Gauge - AWG: 14~26; Wire Gauge - mm2: 1.5; Operating Temperature Range: -40℃~+105℃; Color: 绿色; Number of Pins: 2P
U5 = SMAJ3.3CA_C2959732: 反向截止电压(Vrwm):3.3V;最大钳位电压:7.3V;峰值脉冲电流(Ipp)@10/1000us:54.8A;击穿电压:4.3V;; LCSC Part Name: 双向TVS 3.3V截止 54.8A峰值脉冲; Supplier Part: C2959732; Manufacturer: DOWO(东沃); Supplier Footprint: DO-214AC(SMA); JLCPCB Part Class: 扩展库; Datasheet: https://atta.szlcsc.com/upload/public/pdf/source/20230907/F75F58FD37A2D234DDB5398E22AE45A6.pdf; Supplier: LCSC; Reverse Stand-Off Voltage (Vrwm): 3.3V; Maximum Clamping Voltage: 7.3V; Peak Pulse Current (Ipp)@10/1000us: 54.8A; Breakdown Voltage: 4.3V; Reverse Leakage Current (Ir): 200uA; Type: TVS

## Nets
3V3: H1.1 R1.1 R9.1 R11.2 R12.2 U1.1(VCC) U4.2 U5.1
+5V: U3.10(VDD)
GND: H1.4 LED1_POWER1.2(-) R8.1 R10.2 U1.8(GND) U3.4(GND) U4.1 U5.2 U6.1
ADC_IN1: R8.2 U1.7(PA1)
IIC_SCL: R12.1 U1.3(PA3) U3.2(SCL)
IIC_SDA: R11.1 U1.2(PA4/PA10) U3.3(SDA)
NRST: U1.6(PA2/PF2-NRST)
SWCLK: H1.2 R9.2 U1.4(PA14-SWC/PB3)
SWDIO: H1.3 R10.1 U1.5(PA13-SWD)
$1N473: U2.7(B) U3.9(B/KI2)
$1N528: U2.4(C) U3.11(C/KI3)
$1N531: U2.2(D) U3.12(D/KI4)
$1N534: U2.1(E) U3.13(E/KI5)
$1N537: U2.10(F) U3.14(F/KI6)
$1N540: U2.5(G) U3.15(G/KI7)
$1N543: U2.3(DP) U3.16(DP/KP)
$1N546: U2.11(A) U3.8(A/KI1)
$1N560: U2.6(DIG4) U3.7(DIG4)
$1N574: U2.8(DIG3) U3.6(DIG3)
$1N590: U2.9(DIG2) U3.5(DIG2)
$1N606: U2.12(DIG1) U3.1(DIG1)
$1N1164: LED1_POWER1.1(+) R1.2
$1N1533: R7.1 U6.2
Net-(R7-2): R7.2 R8.3

## Notes on the sheet
- 调试接口
- 电压测量接口
- 数码管
- 主控
- 供电接口

# Schematic PY32F002AAT24V1
Create Date: 2024-02-24; Page Name: P1; Project Name: py32f002; Schematic Name: PY32F002AAT24V1; Update Date: 2024-02-24; Company: 嘉立创EDA; Page Size: A4; Version: V1.0
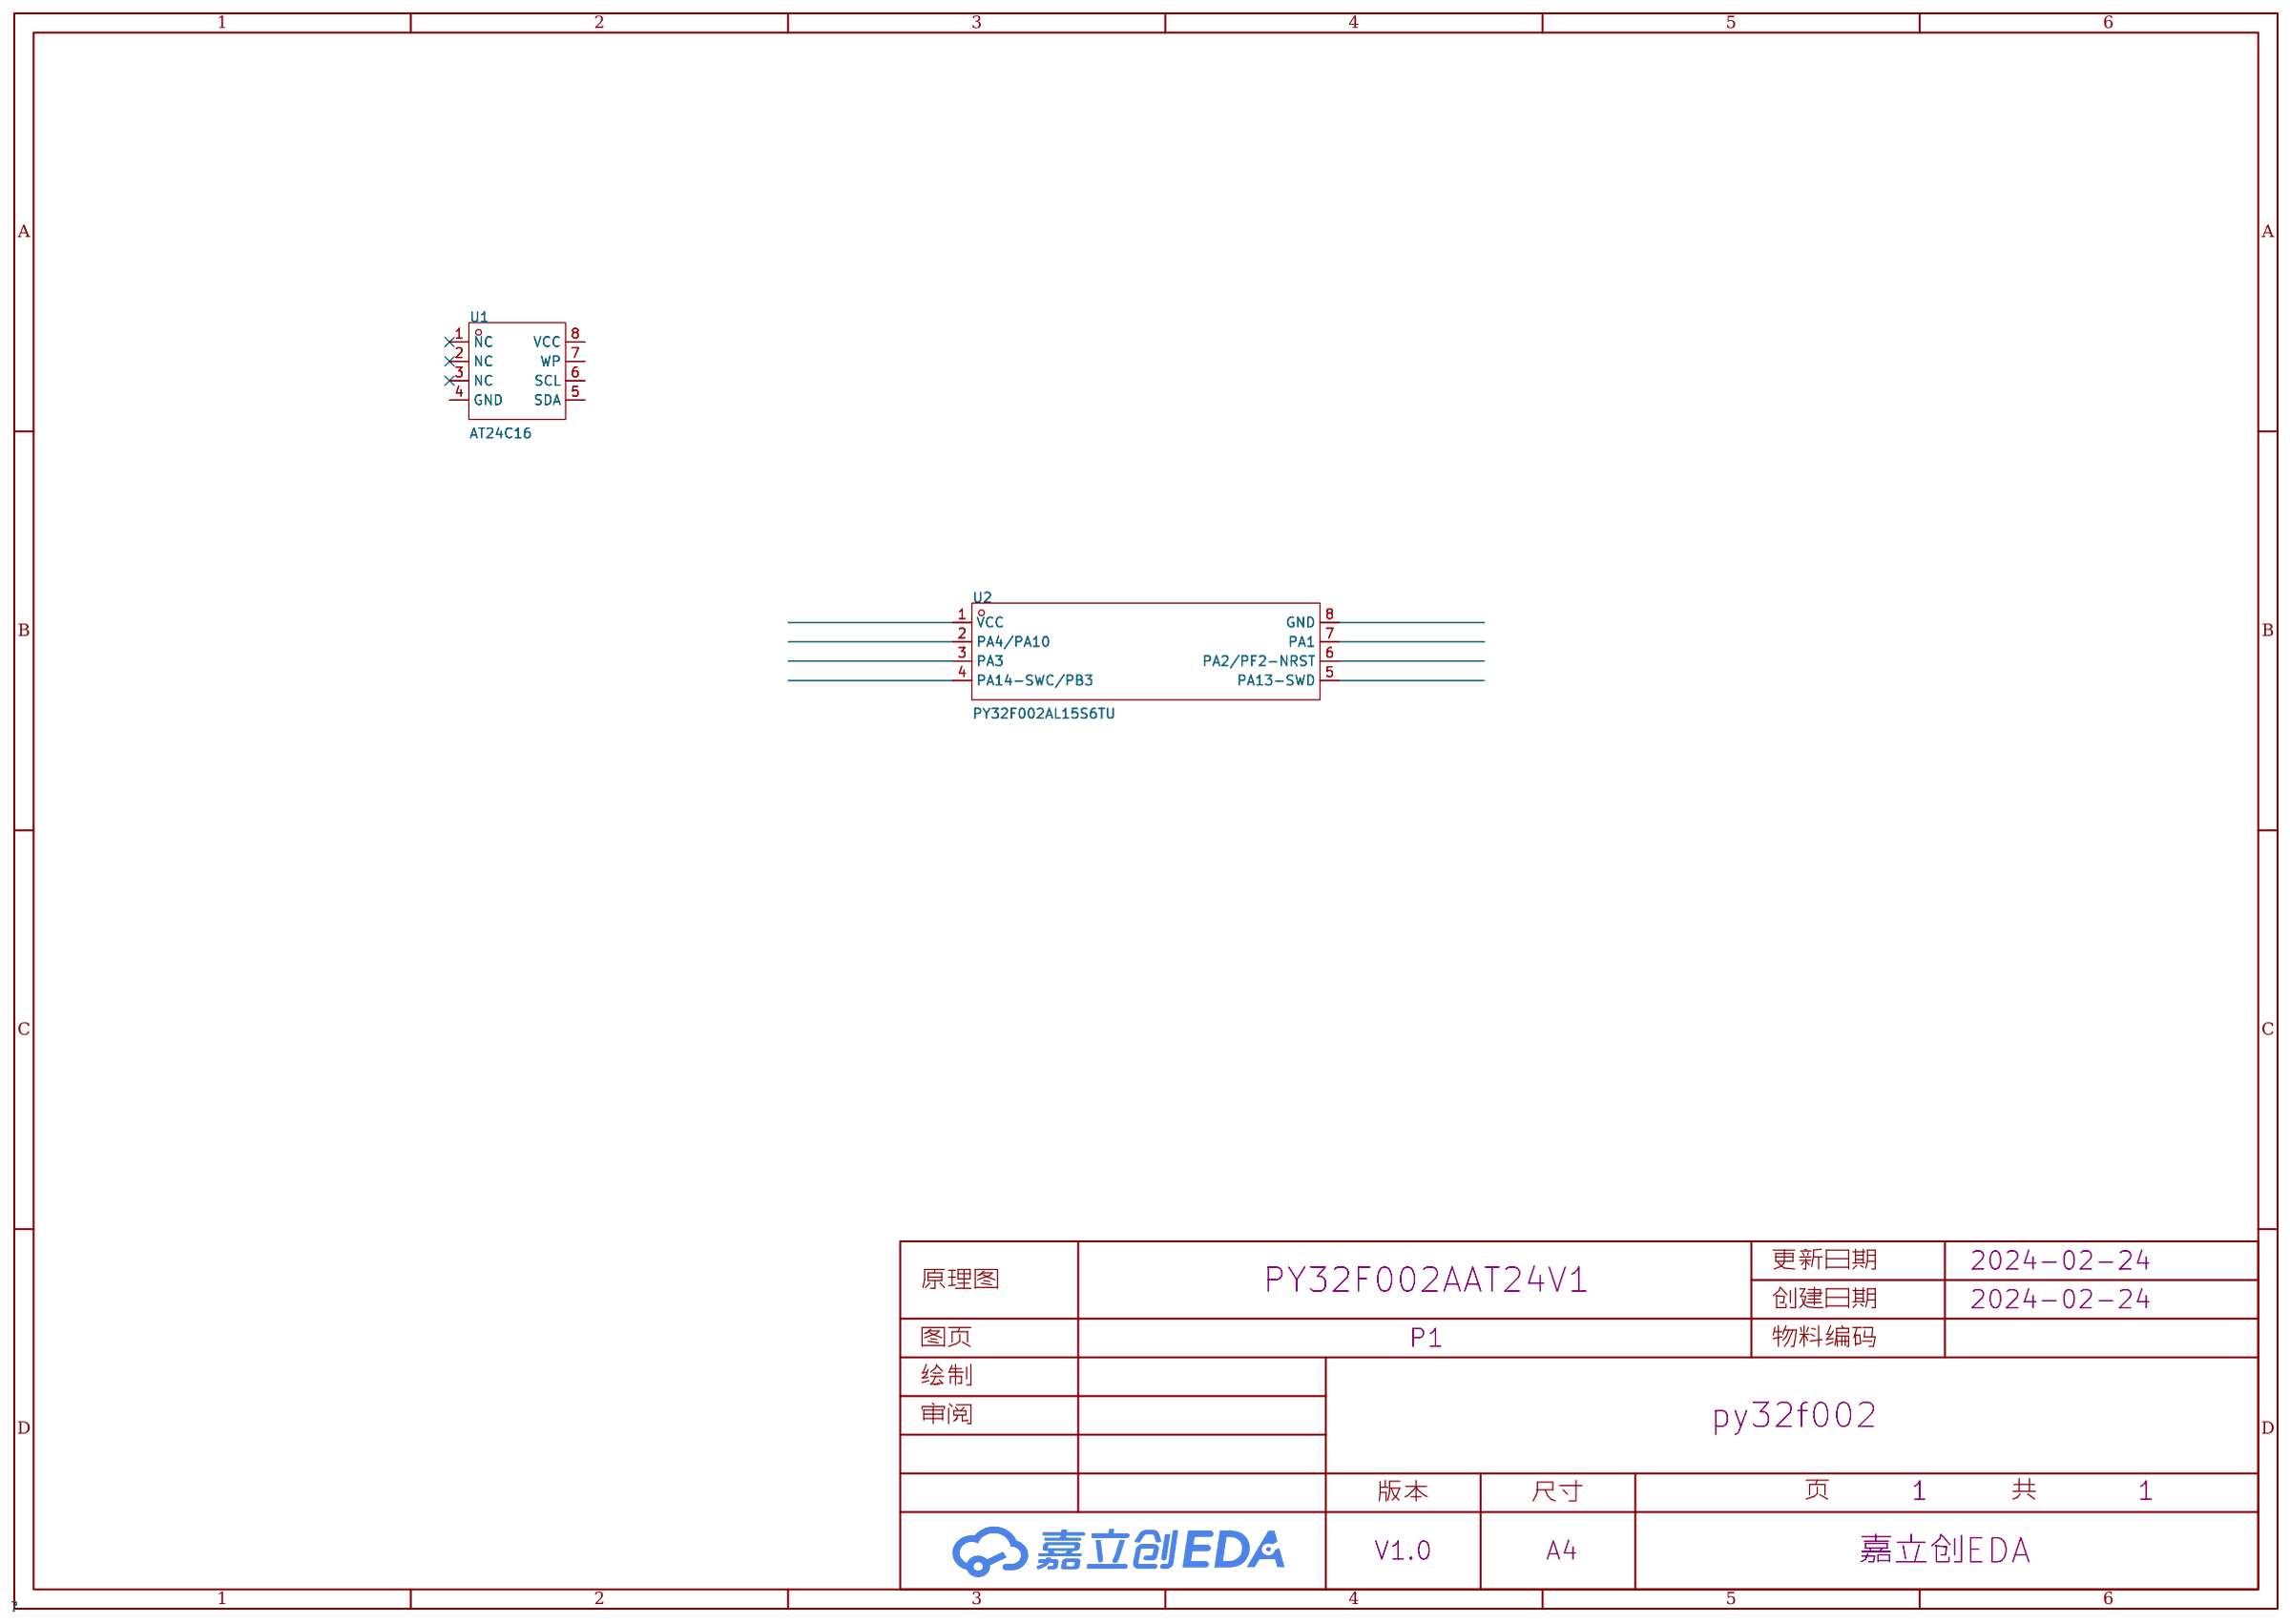
[diagram p2: schematic sheet]

## Parts
U1  AT24C16  [SOP-8_L5.0-W4.0-P1.27-LS6.0-BL]
U2  PY32F002AL15S6TU  [SOP-8_L4.9-W3.9-P1.27-LS6.0-BL-1]

## Library data of the parts
U1 = AT24C16_C561263: 接口类型:I2C;存储容量:-;时钟频率(fc):400kHz~1MHz;; Supplier Part: C561263; Manufacturer: IDCHIP(英锐芯); Supplier Footprint: SOP-8; JLCPCB Part Class: 扩展库; Datasheet: https://atta.szlcsc.com/upload/public/pdf/source/20200527/C561263_AC234663A499CF0B5C3BE8C2059C2B18.pdf; Supplier: LCSC; Interface Type: I2C; Clock Frequency (fc): 400kHz~1MHz; Supply Voltage: 1.8V~5.5V; Supply Current (Read): 400uA; Supply Current (Write): 2mA; Standby supply current: 1uA; Write Cycle Time (Tw): 5ms; Data Retention - TDR (Year): 100年; Write Cycle Endurance: 1000000次; Operating Temperature: -40℃~+85℃
U2 = PY32F002AL15S6TU: 程序存储容量:20KB;RAM总容量:3KB;工作电压范围:1.7V~5.5V;CPU最大主频:24MHz;程序存储器类型:FLASH;; LCSC Part Name: 32位微控制器 单片机 PY32F002AL15S6TU; Supplier Part: C5292060; Manufacturer: PUYA(普冉); Supplier Footprint: SOP-8; JLCPCB Part Class: 扩展库; Datasheet: https://atta.szlcsc.com/upload/public/pdf/source/20230327/672347329C675A87241B0153A51AEBC2.pdf; Supplier: LCSC; Program Storage Size: 20KB; RAM Size: 3KB; Operating Voltage Range: 1.7V~5.5V; CPU Maximum Speed: 24MHz; Program Memory Type: FLASH; ADC (Bit): 12bit

## Nets

Not connected (* = marked no-connect by the designer): U1 1(NC)* 2(NC)* 3(NC)* 4(GND) 5(SDA) 6(SCL) 7(WP) 8(VCC); U2 1(VCC) 2(PA4/PA10) 3(PA3) 4(PA14-SWC/PB3) 5(PA13-SWD) 6(PA2/PF2-NRST) 7(PA1) 8(GND)

# Schematic PY32F002ATSSOP20V2
Create Date: 2024-03-03; Page Name: P1; Project Name: py32f002; Schematic Name: PY32F002ATSSOP20V2; Update Date: 2024-05-11; Company: 嘉立创EDA; Page Size: A4; Version: V1.0
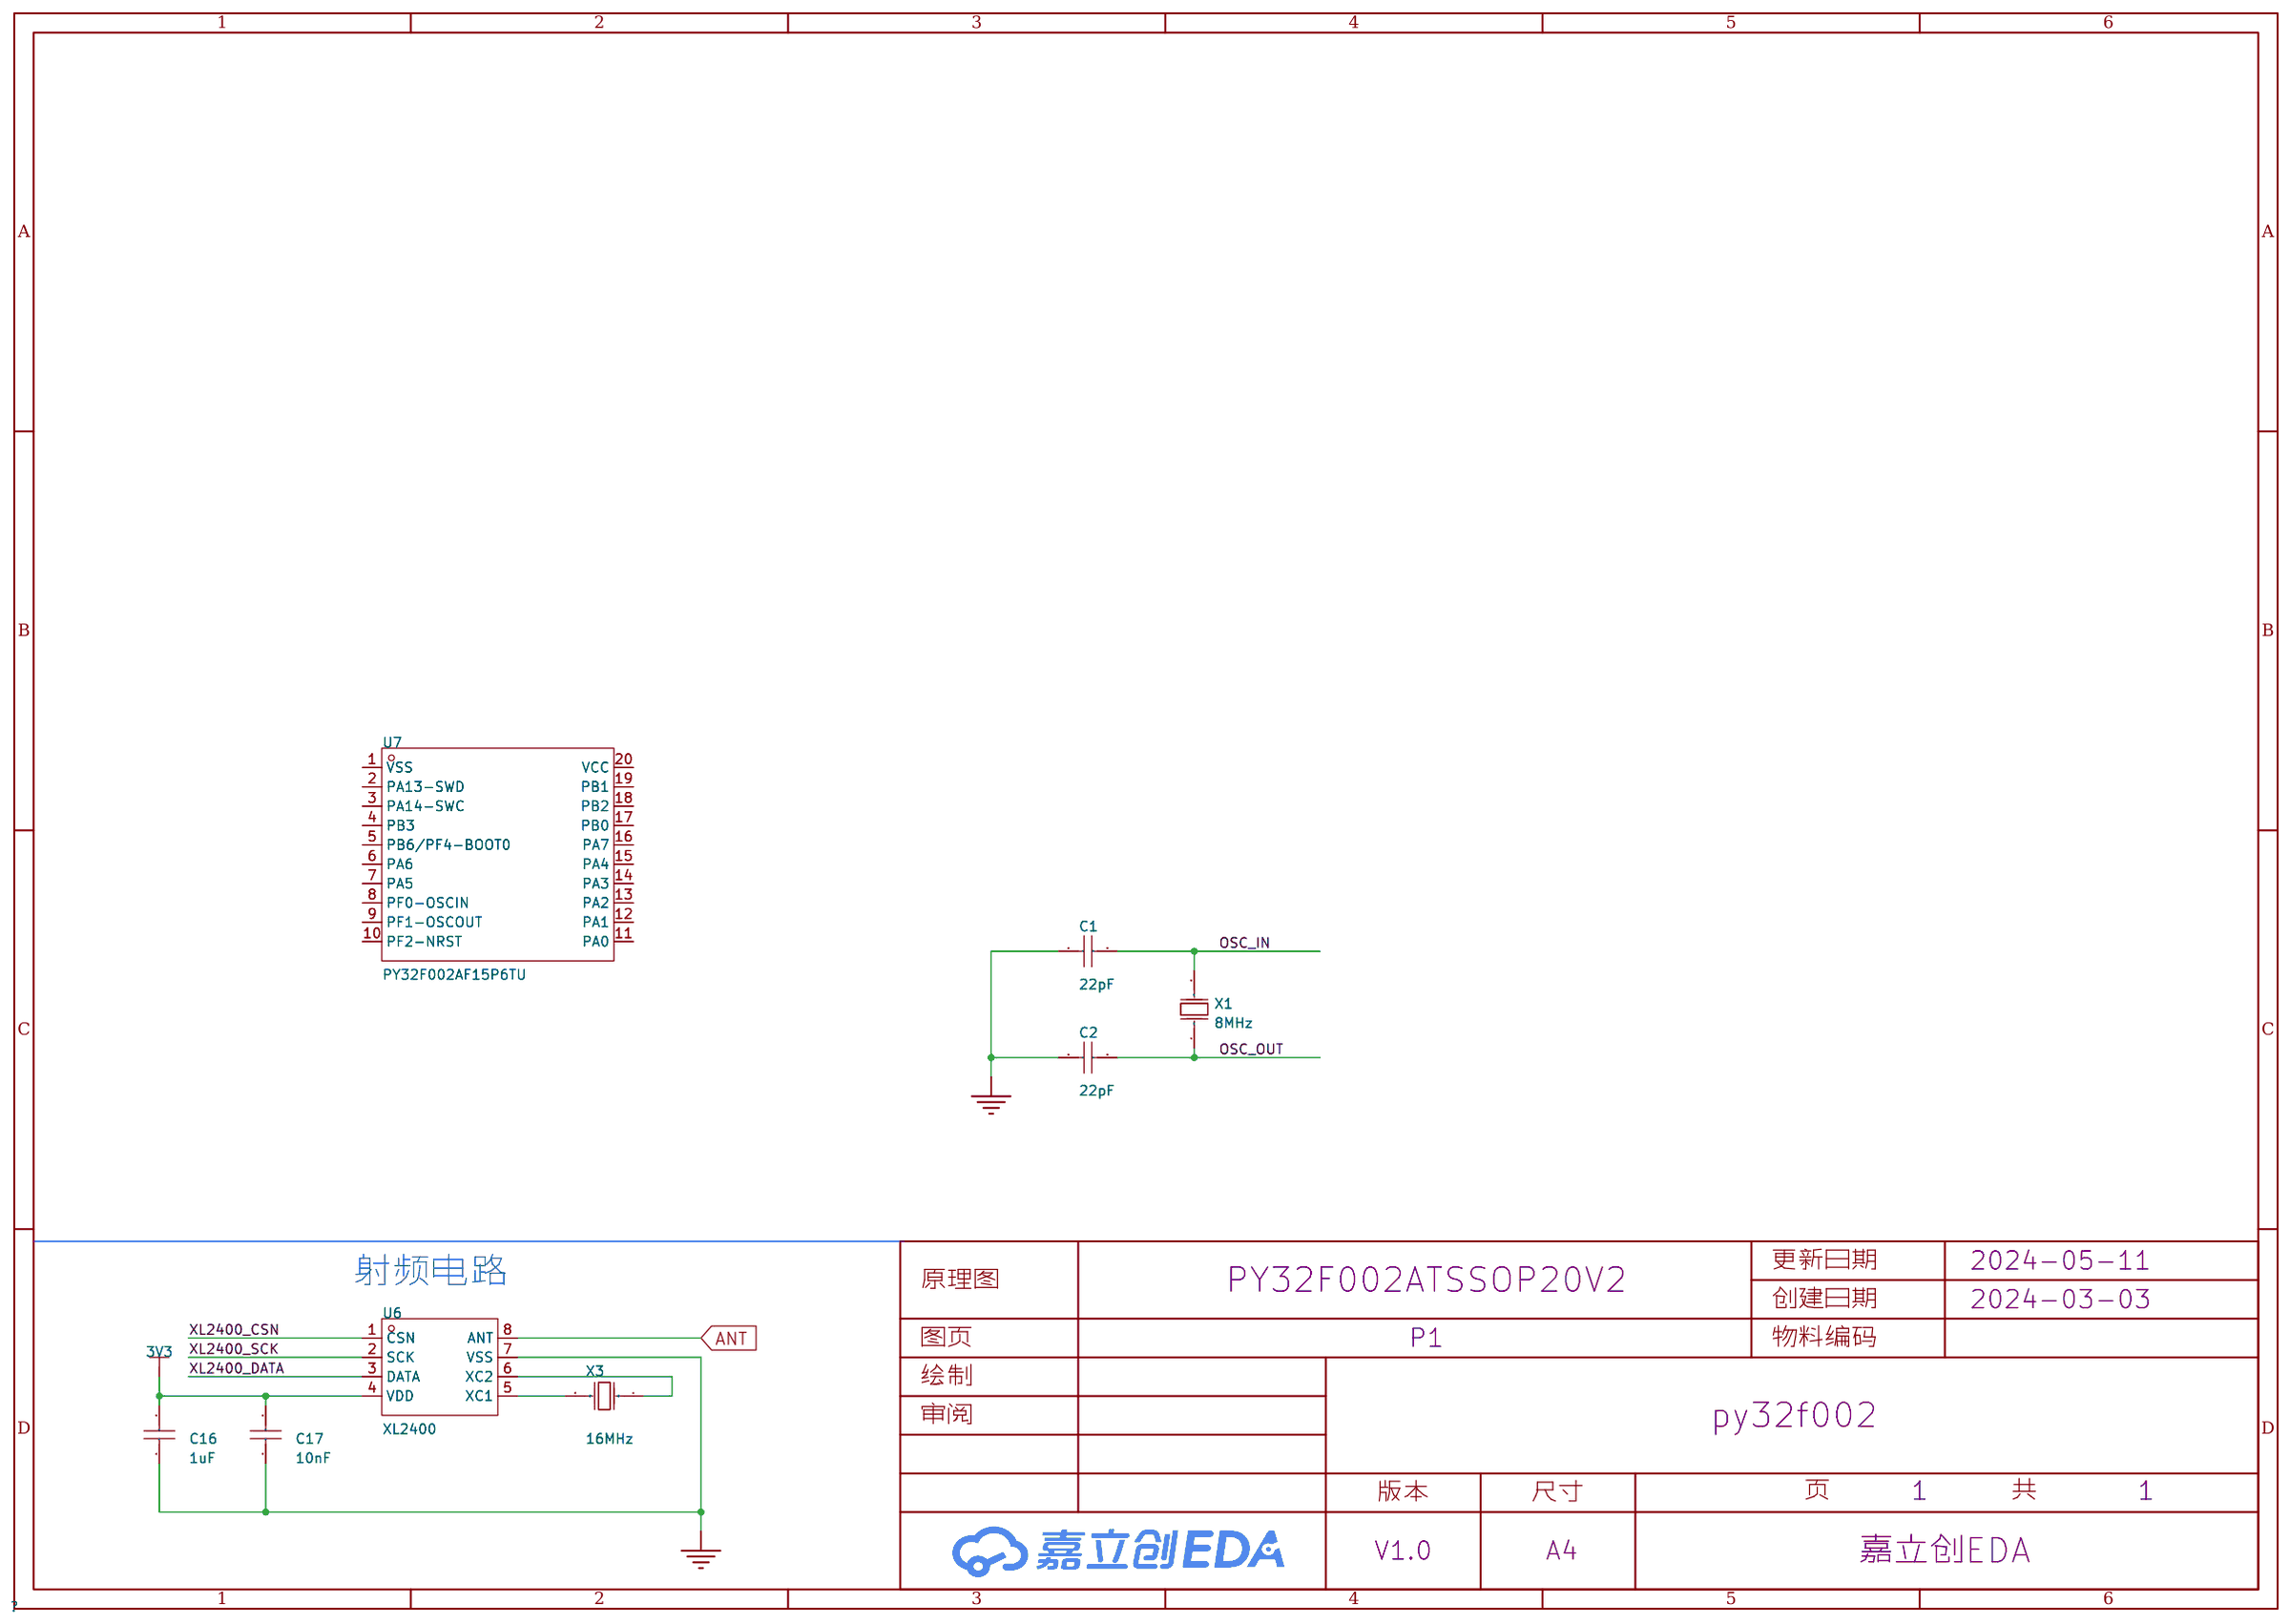
[diagram p3: schematic sheet]

## Parts
C1  22pF  [C0603]
C2  22pF  [C0603]
C16  1uF  [C0603]
C17  10nF  [C0603]
U6  XL2400  [SOIC-8_L4.9-W3.9-P1.27-LS6.2-BL]
U7  PY32F002AF15P6TU  [TSSOP-20_L6.5-W4.4-P0.65-LS6.4-BL]
X1  8MHz  [CRYSTAL-SMD_L11.5-W4.8-LS12.7]
X3  16MHz  [OSC-TH_L10.0-W4.5-P5.00]

## Library data of the parts
C1 C2 = CL10C220JB8NNNC: 容值:22pF;精度:±5%;额定电压:50V;材质(温度系数):C0G;; LCSC Part Name: 22pF ±5% 50V; Supplier Part: C1653; Manufacturer: SAMSUNG(三星); Supplier Footprint: 0603; JLCPCB Part Class: 基础库; Datasheet: https://atta.szlcsc.com/upload/public/pdf/source/20160218/1457707763339.pdf; Supplier: LCSC; Tolerance: ±5%; Voltage Rated: 50V; Temperature Coefficient: C0G
C16 = CL10A105KB8NNNC: 容值:1uF;精度:±10%;额定电压:50V;材质(温度系数):X5R;; LCSC Part Name: 1uF ±10% 50V; Supplier Part: C15849; Manufacturer: SAMSUNG(三星); Supplier Footprint: 0603; JLCPCB Part Class: 基础库; Datasheet: https://atta.szlcsc.com/upload/public/pdf/source/20160218/1457707763339.pdf; Supplier: LCSC; Tolerance: ±10%; Voltage Rated: 50V; Temperature Coefficient: X5R
C17 = CC0603KRX7R9BB103: 容值:10nF;精度:±10%;额定电压:50V;材质(温度系数):X7R;; LCSC Part Name: 10nF ±10% 50V; Supplier Part: C100042; Manufacturer: YAGEO(国巨); Supplier Footprint: 0603; JLCPCB Part Class: 扩展库; Datasheet: https://atta.szlcsc.com/upload/public/pdf/source/20181008/C309510_22F155564471FAF6A489F7D68F34234E.pdf; Supplier: LCSC; Tolerance: ±10%; Voltage Rated: 50V; Temperature Coefficient: X7R
U6 = XL2400: Supplier Part: C9900085260; Supplier Footprint: SOIC-8; Supplier: LCSC
U7 = PY32F002AF15P6TU: 程序存储容量:20KB;RAM总容量:3KB;工作电压范围:1.7V~5.5V;CPU最大主频:24MHz;程序存储器类型:FLASH;; LCSC Part Name: 32位微控制器 单片机  PY32F002AF15P6TU; Supplier Part: C5292059; Manufacturer: PUYA(普冉); Supplier Footprint: TSSOP-20; JLCPCB Part Class: 扩展库; Datasheet: https://atta.szlcsc.com/upload/public/pdf/source/20230327/672347329C675A87241B0153A51AEBC2.pdf; Supplier: LCSC; Program Storage Size: 20KB; RAM Size: 3KB; Operating Voltage Range: 1.7V~5.5V; CPU Maximum Speed: 24MHz; Program Memory Type: FLASH; ADC (Bit): 12bit
X1 = X49SM8MSD2SC: 晶振类型:贴片晶振;频率:8MHz;常温频差:±20ppm;外接负载电容:20pF;频率稳定度(全温):±30ppm;; LCSC Part Name: 8MHz ±20ppm 20pF; Supplier Part: C12674; Manufacturer: YXC(扬兴晶振); Supplier Footprint: HC-49S-SMD; JLCPCB Part Class: 基础库; Datasheet: https://atta.szlcsc.com/upload/public/pdf/source/20210329/C106809_0E91E60850A780B284B63D653DC40EA4.pdf; Supplier: LCSC; Crystal Type: 贴片晶振; Normal temperature Frequency Tolerance: ±20ppm; External load capacitor: 20pF; Frequency Stability(Full temperature range): ±30ppm; Operating Temperature: -20℃~+70℃
X3 = X49SD16MSD2SC: 晶振类型:直插晶振;频率:16MHz;常温频差:±20ppm;外接负载电容:20pF;频率稳定度(全温):±30ppm;; LCSC Part Name: 16MHz ±20ppm 20pF; Supplier Part: C16212; Manufacturer: YXC(扬兴晶振); Supplier Footprint: HC-49S; JLCPCB Part Class: 扩展库; Datasheet: https://atta.szlcsc.com/upload/public/pdf/source/20240329/977D7F2434F98B2BE33270BB9FF3D86D.pdf; Supplier: LCSC; Crystal Type: 直插晶振; Normal temperature Frequency Tolerance: ±20ppm; External load capacitor: 20pF; Frequency Stability(Full temperature range): ±30ppm; Operating Temperature: -20℃~+70℃

## Nets
3V3: C16.1 C17.1 U6.4(VDD)
GND: C1.1 C2.1 C16.2 C17.2 U6.7(VSS)
ANT: U6.8(ANT)
OSC_IN: C1.2 X1.2(OSC2)
OSC_OUT: C2.2 X1.1(OSC1)
XL2400_CSN: U6.1(CSN)
XL2400_DATA: U6.3(DATA)
XL2400_SCK: U6.2(SCK)
Net-(U6-5): U6.5(XC1) X3.2(OSC2)
Net-(U6-6): U6.6(XC2) X3.1(OSC1)

Not connected (* = marked no-connect by the designer): U7 1(VSS) 2(PA13-SWD) 3(PA14-SWC) 4(PB3) 5(PB6/PF4-BOOT0) 6(PA6) 7(PA5) 8(PF0-OSCIN) 9(PF1-OSCOUT) 10(PF2-NRST) 11(PA0) 12(PA1) 13(PA2) 14(PA3) 15(PA4) 16(PA7) 17(PB0) 18(PB2) 19(PB1) 20(VCC)

## Notes on the sheet
- 射频电路

# Board PY32F002ASOP20V1
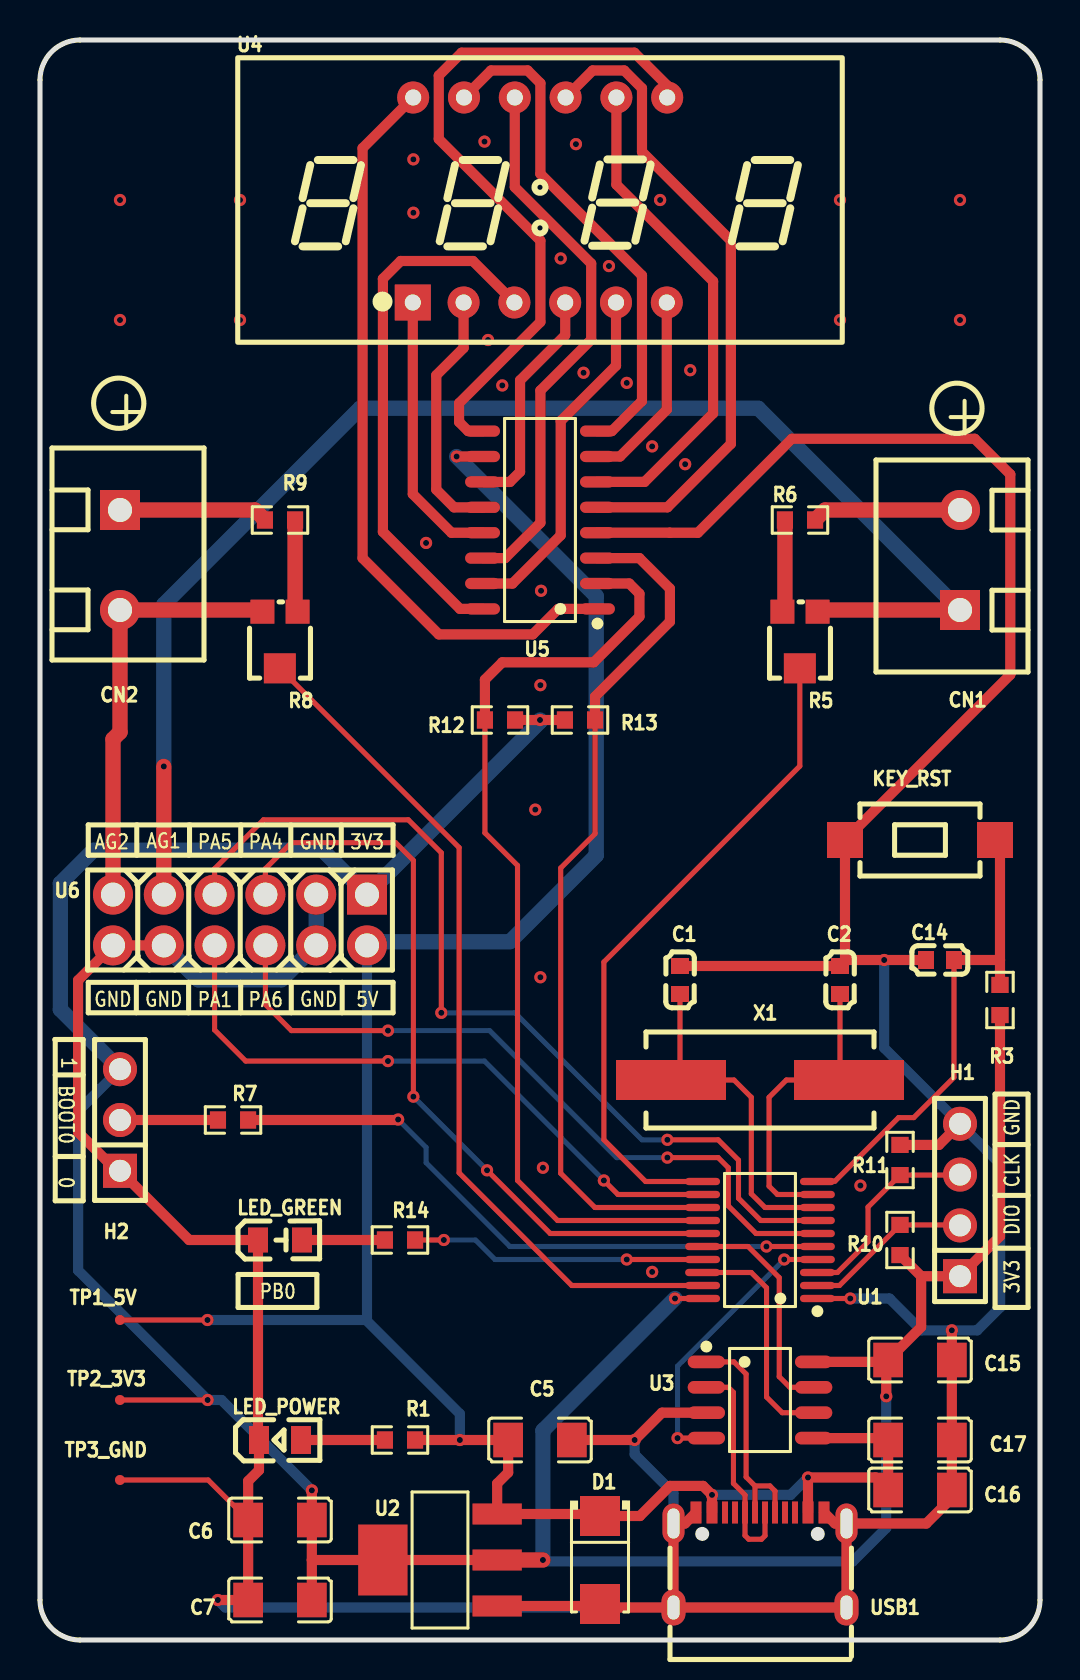
[diagram p4: board, top side]
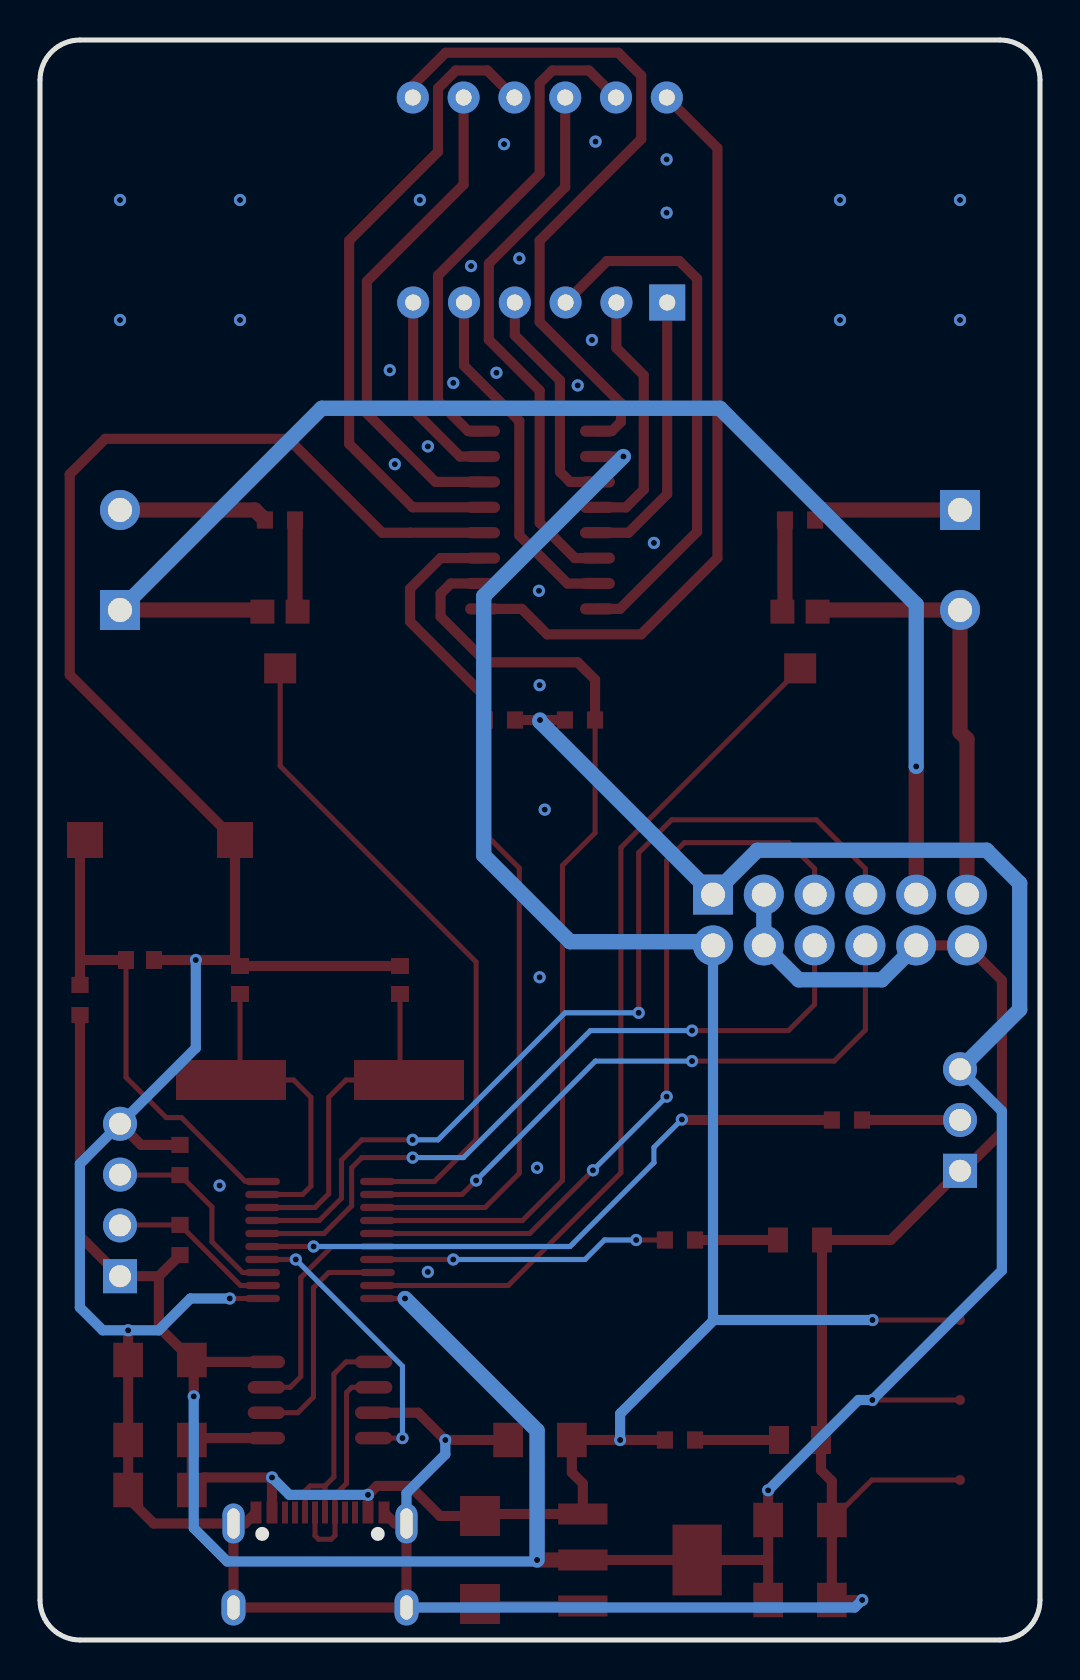
[diagram p5: board, bottom side, seen from below]

Outline 50 x 80 mm; copper layers: Top Layer, Bottom Layer. Coordinates in mm from the lower left corner of the outline.
Outline path: 0,78 0,2 arc(0.59,0.59) 2,0 48,0 arc(49.41,0.59) 50,2 50,78 arc(49.41,79.41) 48,80 2,80 arc(0.59,79.41) 0,78
Stack: Top Layer 0.035mm / Dielectric1 1.51mm FR4 er 4.5 / Bottom Layer 0.035mm

## Design rules (mm)
template: JLCPCB Capability(Two Layers Board)
spacing copperThickness1oz (default): track to track 0.102, other pairs 0.152 to 0.3
spacing copperThickness2oz: track to track 0.203, other pairs 0.152 to 0.3
track width copperThickness1oz (default): min 0.127, default 0.254, max 2.54
track width copperThickness2oz: min 0.203, default 0.254, max 2.54
differential pair differentialPair (default): width min 0.127, default 0.254, max 2.54; gap min 0.152, default 0.152
via viaSize (default): diameter min 0.5, default 0.61, max 10; hole min 0.3, default 0.305, max 6.3

## Placement (name value [footprint] x y rotation side)
C1  22pF  [C0603]  32 33 270 top
C2  22pF  [C0603]  40 33 270 top
C5  47uF  [C1206]  25 10 0 top
C6  47uF  [C1206]  12 6 180 top
C7  100nF  [C1206]  12 2 180 top
C14  100nF  [C0603]  45 34 0 top
C15  100nF  [C1206]  44 14 0 top
C16  10uF  [C1206]  44 7.5 0 top
C17  100nF  [C1206]  44 10 0 top
CN1  MX301-5.0-02P-BU01-Cu-Y-A  [CONN-TH_2P-P5.0-MX301-5.0-02P-BU01-CU-Y-A]  46 54 90 top
CN2  MX301-5.0-02P-BU01-Cu-Y-A  [CONN-TH_2P-P5.0-MX301-5.0-02P-BU01-CU-Y-A]  4 54 270 top
D1  SMAJ5.0A  [SMA_L4.3-W2.6-LS5.2-RD]  28 4 270 top
H1  PZ254V-11-04P  [HDR-TH_4P-P2.54-V-M]  46 22 90 top
H2  PZ254V-11-03P  [HDR-TH_3P-P2.54-V-M]  4 26 90 top
KEY_RST  TC-3602-4.3-260G  [KEY-SMD_L6.0-W3.6-LS8.3-L]  44 40 180 top
LED_GREEN  MHT170UGCT  [LED0805-RD]  12 20 0 top
LED_POWER  NCD0805R1  [LED0805-R-RD]  12 10 0 top
R1  1kΩ  [R0603]  18 10 180 top
R3  10kΩ  [R0603]  48 32 270 top
R5  2kΩ  [RES-ADJ-SMD_3P-L3.8-W3.6_TC33X-2-502E]  38 50 180 top
R6  10kΩ  [R0603]  38 56 0 top
R7  10kΩ  [R0603]  9.65 26 180 top
R8  2kΩ  [RES-ADJ-SMD_3P-L3.8-W3.6_TC33X-2-502E]  12 50 180 top
R9  10kΩ  [R0603]  12 56 180 top
R10  10kΩ  [R0603]  43 20 90 top
R11  10kΩ  [R0603]  43 24 90 top
R12  2.2kΩ  [R0603]  23 46 0 top
R13  2.2kΩ  [R0603]  27 46 180 top
R14  330Ω  [R0603]  18 20 180 top
TP1_5V  -  [Test-Point-0.5mm]  4 16 0 top
TP2_3V3  -  [Test-Point-0.5mm]  4 12 270 top
TP3_GND  -  [Test-Point-0.5mm]  4 8 0 top
U1  PY32F002AF15P6TU  [TSSOP-20_L6.5-W4.4-P0.65-LS6.4-BL]  36 20 90 top
U2  AMS1117-3.3  [SOT-223_L6.5-W3.5-P2.30-LS7.0-BR]  20 4 0 top
U3  CH340N  [SOP-8_L4.9-W3.9-P1.27-LS6.0-BL]  36 12 270 top
U4  MHDC3641SRBW  [LED-SEG-TH_12P-L30.0-W14.0-P2.54-LS10.2]  25 72 0 top
U5  TM1650  [SOP-16_L10.0-W3.9-P1.27-LS6.0-BL]  25 56 90 top
U6  PZ2.54-2*6  [HDR-TH_12P-P2.54-V-M-R2-C6-S2.54_MOLEX]  10 36 180 top
USB1  TYPE-C 16PIN 2MD(073)  [USB-C-SMD_TYPE-C-6PIN-2MD-073]  36 4 0 top
X1  8MHz  [CRYSTAL-SMD_L11.5-W4.8-LS12.7]  36 28 180 top

## Footprints (pads in the part's own frame, mm; a bottom-side part is the same pattern mirrored in y, then rotated)
C0603
  rect 0.8x0.9 smd: 1(-0.7,0) 2(0.7,0)
C1206
  rect 1.485x1.728 smd: 1(-1.593,0) 2(1.593,0)
CONN-TH_2P-P5.0-MX301-5.0-02P-BU01-CU-Y-A
  rect 2x2 hole 1.2: 1(-2.5,0)
  round 2 hole 1.2: 2(2.5,0)
CRYSTAL-SMD_L11.5-W4.8-LS12.7
  rect 5.5x2 smd: 1(-4.45,0) 2(4.45,0)
HDR-TH_3P-P2.54-V-M
  rect 1.7x1.7 hole 1.1: 1(-2.54,0)
  round 1.7 hole 1.1: 2(0,0) 3(2.54,0)
HDR-TH_4P-P2.54-V-M
  rect 1.7x1.7 hole 1.1: 1(-3.81,0)
  round 1.7 hole 1.1: 2(-1.27,0) 3(1.27,0) 4(3.81,0)
HDR-TH_12P-P2.54-V-M-R2-C6-S2.54_MOLEX
  rect 2x2 hole 1.2: 1(-6.35,-1.27)
  round 2 hole 1.2: 2(-6.35,1.27) 3(-3.81,-1.27) 4(-3.81,1.27) 5(-1.27,-1.27) 6(-1.27,1.27) 7(1.27,-1.27) 8(1.27,1.27) 9(3.81,-1.27) 10(3.81,1.27) 11(6.35,-1.27) 12(6.35,1.27)
KEY-SMD_L6.0-W3.6-LS8.3-L
  rect 1.8x1.8 smd: 1(-3.75,0) 2(3.75,0)
LED0805-R-RD
  rect 1x1.399 smd: 1(1.05,0) 2(-1.05,0)
LED0805-RD
  rect 1x1.25 smd: 1(-1.1,0) 2(1.1,0)
LED-SEG-TH_12P-L30.0-W14.0-P2.54-LS10.2
  rect 1.8x1.8 hole 0.8: 1(-6.36,-5.125)
  round 1.6 hole 0.8: 2(-3.82,-5.125) 3(-1.28,-5.125) 4(1.26,-5.125) 5(3.8,-5.125) 6(6.34,-5.125) 7(6.36,5.125) 8(3.82,5.125) 9(1.28,5.125) 10(-1.26,5.125) 11(-3.8,5.125) 12(-6.34,5.125)
R0603
  rect 0.806x0.864 smd: 1(-0.753,0) 2(0.753,0)
RES-ADJ-SMD_3P-L3.8-W3.6_TC33X-2-502E
  rect 1.2x1.2 smd: 1(-0.879,-1.415) 3(0.879,-1.415)
  rect 1.6x1.5 smd: 2(0.009,1.415)
SMA_L4.3-W2.6-LS5.2-RD
  rect 2x2 smd: 1(-2.2,0) 2(2.2,0)
SOP-8_L4.9-W3.9-P1.27-LS6.0-BL
  oval 0.63x1.865 smd: 1(-1.905,-2.683) 2(-0.635,-2.683) 3(0.635,-2.683) 4(1.905,-2.683) 5(1.905,2.683) 6(0.635,2.683) 7(-0.635,2.683) 8(-1.905,2.683)
SOP-16_L10.0-W3.9-P1.27-LS6.0-BL
  oval 0.56x1.745 smd: 1(-4.445,-2.873) 2(-3.175,-2.873) 3(-1.905,-2.873) 4(-0.635,-2.873) 5(0.635,-2.873) 6(1.905,-2.873) 7(3.175,-2.873) 8(4.445,-2.873) 9(4.445,2.873) 10(3.175,2.873) 11(1.905,2.873) 12(0.635,2.873) 13(-0.635,2.873) 14(-1.905,2.873) 15(-3.175,2.873) 16(-4.445,2.873)
SOT-223_L6.5-W3.5-P2.30-LS7.0-BR
  rect 2.465x1.05 smd: 1(2.857,-2.3) 2(2.857,0) 3(2.857,2.3)
  rect 2.465x3.54 smd: 4(-2.857,0)
Test-Point-0.5mm
  round 0.5 smd: 1(0,0)
TSSOP-20_L6.5-W4.4-P0.65-LS6.4-BL
  oval 0.364x1.742 smd: 1(-2.925,-2.871) 2(-2.275,-2.871) 3(-1.625,-2.871) 4(-0.975,-2.871) 5(-0.325,-2.871) 6(0.325,-2.871) 7(0.975,-2.871) 8(1.625,-2.871) 9(2.275,-2.871) 10(2.925,-2.871) 11(2.925,2.871) 12(2.275,2.871) 13(1.625,2.871) 14(0.975,2.871) 15(0.325,2.871) 16(-0.325,2.871) 17(-0.975,2.871) 18(-1.625,2.871) 19(-2.275,2.871) 20(-2.925,2.871)
USB-C-SMD_TYPE-C-6PIN-2MD-073
  rect 0.55x1.1 smd: 1(-3.2,2.375) 2(-2.4,2.375) 11(2.4,2.375) 12(3.2,2.375)
  rect 0.3x1.1 smd: 3(-1.75,2.375) 4(-1.25,2.375) 5(-0.75,2.375) 6(-0.25,2.375) 7(0.25,2.375) 8(0.75,2.375) 9(1.25,2.375) 10(1.75,2.375)
  oval 1.1x2 hole 0.6x1.5: 13(-4.325,1.825) 14(4.325,1.825)
  oval 1.2x1.8 hole 0.6x1.2: 13(-4.325,-2.375) 14(4.325,-2.375)

## Nets
As in the schematic.

Pads without a net: USB1 3 4 9 10

## Via types
v1: diameter 0.61, hole 0.305, Top Layer to Bottom Layer, 61 vias

## Routing (per net, layer and track width the routed paths; a pad name or vN(x,y) marks a point on that pad's centre or on a via; arc(x,y) is an arc through that point)
3V3: length 160.2
  Top Layer w0.254: U1.20 v1(31.75,17.07) ; TP2_3V3.1 v1(8.38,12)
  Top Layer w0.508: v1(42.31,12.18) 42.31,13.91 ; 42.31,13.91 C15.1 44.06,15.65 44.06,18.19 ; 42.31,13.91 U3.8 ; R13.2 R12.2 ; 13.59,4 U2.4 U2.2 ; 13.59,4 C6.1 v1(13.59,7.48) ; 13.59,4 C7.1 ; R10.1 44.06,18.19 ; 44.06,18.19 H1.1 48,20.19 R3.2
  Top Layer w0.762: U2.2 v1(25.15,4)
  Bottom Layer w0.508: v1(25.15,4) 25.22,3.93 40.64,3.93 42.31,5.6 v1(42.31,12.18) ; v1(13.59,7.48) 9.08,12 v1(8.38,12) 1.91,18.48 1.91,26.44 H2.3
  Bottom Layer w0.762: v1(25,46) 25,45.92 U6.1 14.13,39.49 2.67,39.49 1.02,37.84 1.02,31.52 H2.3 ; v1(31.75,17.07) 25.15,10.47 v1(25.15,4)
+5V: length 115
  Top Layer w0.254: 8.38,15.99 v1(8.37,16) TP1_5V.1
  Top Layer w0.508: U3.5 42.31,10.09 C17.1 C16.1 41.78,8.13 v1(38.4,8.13) USB1.11 ; U5.10 v1(20.83,59.17) 20.83,59.17 ; USB1.2 v1(33.6,7.26) 33.15,7.7 31.5,7.7 30,6.2 D1.1 28,6.3 U2.3 22.86,7.82 23.41,8.37 C5.1 v1(20.99,10) R1.1
  Bottom Layer w0.508: v1(33.6,7.26) 37.53,7.26 v1(38.4,8.13) ; 16.3,16 20.99,11.31 v1(20.99,10) ; 16.3,16 v1(8.37,16) ; 16.3,16 16.35,16.05 U6.2
  Bottom Layer w0.762: U6.2 16.53,34.92 23.5,34.92 27.81,39.23 27.81,52.19 v1(20.83,59.17)
AGND1: length 69.7
  Top Layer w0.762: CN1.1 38.96,51.5 R5.1 ; U6.9 v1(6.19,43.68)
  Bottom Layer w0.762: v1(6.19,43.68) 6.19,51.77 16,61.58 35.91,61.58 CN1.1
AGND2: length 21.5
  Top Layer w0.762: R8.3 11.04,51.5 CN2.2 4,45.39 3.65,45.04 U6.11
GND: length 237.5
  Top Layer w0.254: C6.2 8.41,8 TP3_GND.1 ; U1.1 v1(40.51,17.07)
  Top Layer w0.508: USB1.13 28,1.62 28,1.7 ; USB1.13 USB1.14 USB1.14 ; USB1.13 USB1.13 32.25,5.82 USB1.1 ; C1.1 C2.1 40.25,33.95 ; R11.2 44.94,24.75 H1.4 ; 40.25,33.95 KEY_RST.2 48.51,48.26 48.51,58.28 46.74,60.06 37.59,60.06 32.89,55.36 31.5,55.36 31.49,55.36 U5.4 ; 40.25,33.95 40.3,34 v1(42.21,34) C14.1 ; 28,1.7 U2.1 ; 28,1.7 D1.2 ; U3.3 31.1,11.37 v1(29.73,10) C5.2 ; USB1.14 39.75,5.82 USB1.12 ; USB1.14 44.32,5.82 45.59,7.1 C17.2 C15.2 v1(45.59,15.48) ; v1(8.89,2) C7.2 C6.2 10.41,7.95 10.95,8.49 LED_POWER.2 10.9,10.05 LED_GREEN.1 7.46,20 H2.1 3.83,23.46 1.91,25.39 1.91,32.98 U6.12 U6.10
  Bottom Layer w0.508: v1(42.21,34) 42.21,29.6 H1.4 48.01,23.8 48.01,16.63 46.86,15.48 v1(45.59,15.48) 44.07,15.48 42.48,17.07 v1(40.51,17.07) ; v1(8.89,2) 9.26,1.62 USB1.13 ; v1(29.73,10) 29.73,9.28 31.68,7.34 USB1.13
  Bottom Layer w0.762: U6.3 U6.4 13.78,34.73 12.06,33.01 7.91,33.01 U6.10
  vias: v1(4,72) v1(4,66) v1(10,72) v1(10,66) v1(18.67,74.03) v1(18.67,71.36) v1(19.3,54.85) v1(22.22,74.92) v1(22.4,65) v1(23.11,62.73) v1(24.76,41.52) v1(25.02,47.74) v1(25.02,33.14) v1(25.05,52.46) v1(25.15,23.61) v1(26.03,69.08) v1(26.8,74.79) v1(27.18,63.36) v1(28.45,68.7) v1(29.34,62.86) v1(30.61,59.68) v1(30.61,18.41) v1(31.01,72) v1(32.26,58.79) v1(32.51,63.49) v1(40,72) v1(40,66) v1(41.02,22.72) v1(46,72) v1(46,66)
A: length 25.5
  Top Layer w0.508: U5.8 28.59,60.44 30.1,61.95 30.1,68.23 25.02,73.31 25.02,77.84 24.38,78.48 22.55,78.48 U4.11
ADC_IN0: length 33.4
  Top Layer w0.254: R5.2 37.99,43.7 28.19,33.9 28.19,25.01 30.28,22.92 U1.11
ADC_IN9: length 43.4
  Top Layer w0.254: U1.19 26.59,17.72 20.96,23.36 20.96,39.62 R8.2
B: length 35.6
  Top Layer w0.508: U4.7 31.36,77.72 29.72,79.36 21.08,79.36 19.94,78.22 19.94,75.05 25.02,69.97 25.02,65.9 20.96,61.84 20.96,60.9 21.41,60.44 U5.9
BOOT0: length 31.6
  Top Layer w0.254: U1.5 v1(36.32,19.68)
  Top Layer w0.508: R7.1 17.88,26 v1(17.91,26.03)
  Bottom Layer w0.254: v1(17.91,26.03) 19.3,24.63 19.3,23.87 23.5,19.68 v1(36.32,19.68)
C: length 11.5
  Top Layer w0.508: U5.11 22.13,57.9 23.5,57.9 24,58.41 24,62.98 26.26,65.24 U4.4
D: length 12.6
  Top Layer w0.508: U5.12 22.12,56.63 20.7,56.63 19.81,57.52 19.81,63.24 21.18,64.6 U4.2
DIG1: length 37.9
  Top Layer w0.508: U4.12 16.13,74.59 16.13,54.09 19.94,50.28 24.64,50.28 25.91,51.56 U5.1
DIG2: length 32.4
  Top Layer w0.508: U5.5 31.37,56.64 34.54,59.81 34.54,69.97 30.1,74.41 30.1,77.59 29.21,78.48 27.63,78.48 U4.9
DIG3: length 25
  Top Layer w0.508: U5.6 30.23,57.91 33.66,61.33 33.66,67.94 28.82,72.77 U4.8
DIG4: length 9.8
  Top Layer w0.508: U5.7 29,59.17 31.34,61.52 U4.6
DP: length 27
  Top Layer w0.508: U4.3 21.64,68.95 18.03,68.95 17.15,68.06 17.15,55.41 21,51.56 U5.16
E: length 13.9
  Top Layer w0.508: U4.1 18.64,57.3 20.57,55.36 22.12,55.36 U5.13
F: length 27.5
  Top Layer w0.508: U4.10 23.74,72.64 27.56,68.82 27.56,65.01 25.02,62.47 25.02,55.86 23.25,54.09 U5.14
G: length 17.7
  Top Layer w0.508: U4.5 28.8,63.72 26.03,60.95 26.03,55.23 23.62,52.82 22.13,52.82 U5.15
I2C_SCL: length 48.3
  Top Layer w0.254: R12.1 22.25,40.35 23.88,38.72 23.88,22.98 25.88,20.97 U1.14
  Top Layer w0.508: U5.2 29.46,52.83 29.97,52.31 29.97,51.17 27.69,48.89 23.11,48.89 22.25,48.02 R12.1
I2C_SDA: length 43.6
  Top Layer w0.254: R13.1 27.75,40.32 26.03,38.6 26.03,23.33 27.74,21.62 U1.13
  Top Layer w0.508: U5.3 29.97,54.09 31.5,52.57 31.5,50.92 27.75,47.17 R13.1
NRST: length 24.5
  Top Layer w0.254: C14.2 45.7,28.13 43.69,26.12 42.93,26.12 39.75,22.94 38.89,22.94 U1.10
  Top Layer w0.508: KEY_RST.1 48,39.75 48,34 ; C14.2 48,34 48,34 ; 48,34 R3.1
OSC_IN: length 17.3
  Top Layer w0.254: C1.2 32,28.45 X1.2 34.7,28 35.56,27.14 35.56,22.31 36.25,21.62 U1.8
OSC_OUT: length 15.9
  Top Layer w0.254: U1.9 36.87,22.28 36.45,22.69 36.45,27.14 37.32,28 X1.1 40,28.45 C2.2
PA1: length 32
  Top Layer w0.254: v1(28.19,22.98) 28.9,22.28 U1.12 ; v1(17.4,28.95) 10.29,28.95 8.73,30.5 U6.8
  Bottom Layer w0.254: v1(17.4,28.95) 22.22,28.95 v1(28.19,22.98)
PA4: length 38.7
  Top Layer w0.254: U1.15 25.51,20.32 v1(22.35,23.48) ; U6.5 11.27,38.56 12.57,39.87 17.78,39.87 18.67,38.98 v1(18.67,27.17)
  Bottom Layer w0.254: v1(22.35,23.48) v1(18.67,27.17)
PA5: length 46.6
  Top Layer w0.254: v1(31.37,25.01) 33.91,25.01 34.93,23.99 34.93,22.09 36.04,20.97 U1.7 ; U6.7 8.73,38.56 11.18,41.01 18.41,41.01 20.07,39.36 v1(20.07,31.36)
  Bottom Layer w0.254: v1(31.37,25.01) 30.1,25.01 23.75,31.36 v1(20.07,31.36)
PA6: length 36.4
  Top Layer w0.254: U6.6 11.27,31.77 12.57,30.47 v1(17.4,30.47) ; U1.6 35.8,20.32 34.42,21.71 34.42,23.61 33.91,24.12 v1(31.37,24.12)
  Bottom Layer w0.254: v1(17.4,30.47) 22.48,30.47 28.83,24.12 v1(31.37,24.12)
PB0: length 14.8
  Top Layer w0.254: R14.1 v1(20.19,20) ; U1.17 v1(29.34,19.03)
  Bottom Layer w0.254: v1(29.34,19.03) 22.75,19.03 21.77,20 v1(20.19,20)
RTS: length 14.2
  Top Layer w0.254: U1.4 v1(37.21,19.03) ; U3.4 v1(31.88,10.09)
  Bottom Layer w0.254: v1(37.21,19.03) 31.88,13.69 v1(31.88,10.09)
RX: length 11.4
  Top Layer w0.254: U1.16 35.41,19.68 36.96,18.12 36.96,13.16 37.49,12.63 U3.7
SWCLK: length 10.2
  Top Layer w0.254: H1.3 45.98,23.25 R11.1 41.4,21.65 41.4,19.91 39.87,18.38 U1.3
SWDIO: length 8.4
  Top Layer w0.254: U1.2 39.97,17.72 R10.2 45.98,20.75 H1.2
TX: length 11.7
  Top Layer w0.254: U1.18 35.56,18.38 36.33,17.61 36.33,12.15 37.11,11.37 U3.6
UD+: length 11.5
  Top Layer w0.254: 35.75,7.7 USB1.6 ; 35.75,7.7 36.5,7.7 36.75,7.45 USB1.8 ; 35.75,7.7 35.31,8.15 35.31,13.3 34.7,13.91 U3.1
UD-: length 11.2
  Top Layer w0.254: USB1.7 36.25,5.21 36.07,5.04 35.44,5.04 35.25,5.22 USB1.5 35.25,7.25 34.67,7.83 34.67,12.38 34.42,12.63 U3.2
$1N1634: length 4.2
  Top Layer w0.508: LED_POWER.1 R1.2
$1N8558: length 4.9
  Top Layer w0.508: H2.2 R7.2
$1N8622: length 4.6
  Top Layer w0.762: R8.1 12.75,51.54 R9.1
$1N8806: length 7.5
  Top Layer w0.762: R9.2 10.75,56.5 CN2.1
$1N8861: length 7.5
  Top Layer w0.762: R6.2 39.25,56.5 CN1.2
$1N9077: length 4.1
  Top Layer w0.508: LED_GREEN.2 R14.2
$1N9272: length 4.6
  Top Layer w0.762: R6.1 37.25,51.54 R5.3

## Copper pours and planes (outline as drawn; the poured copper is in the pictures)
GND on Top Layer: 0,80 50,80 50,0 0,0
GND on Bottom Layer: 0,80 50,80 50,0 0,0

## Text on the board
Top Silkscreen Layer: BOOT0 | 0 | 1 | GND | AG2 | AG1 | PA1 | PA5 | PA6 | PA4 | PB0 | 3V3 | 5V | CLK | DIO | +

# Board PY32F002ATSSOP8V1
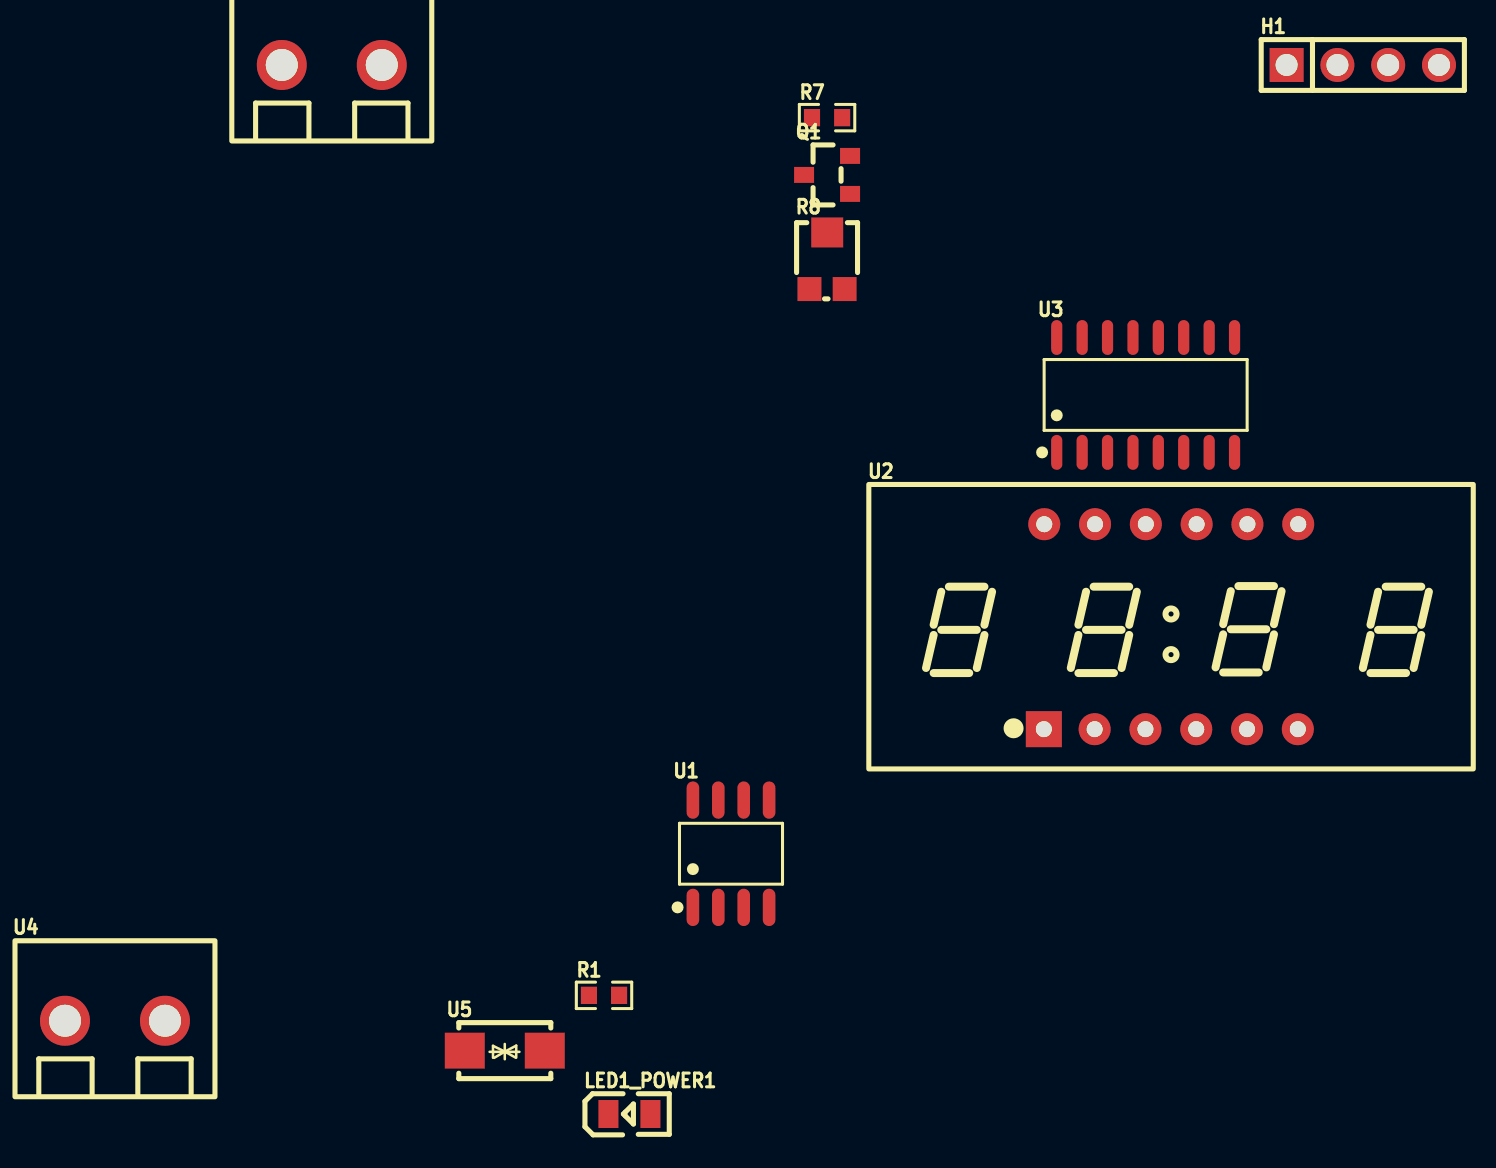
[diagram p6: board, top side]
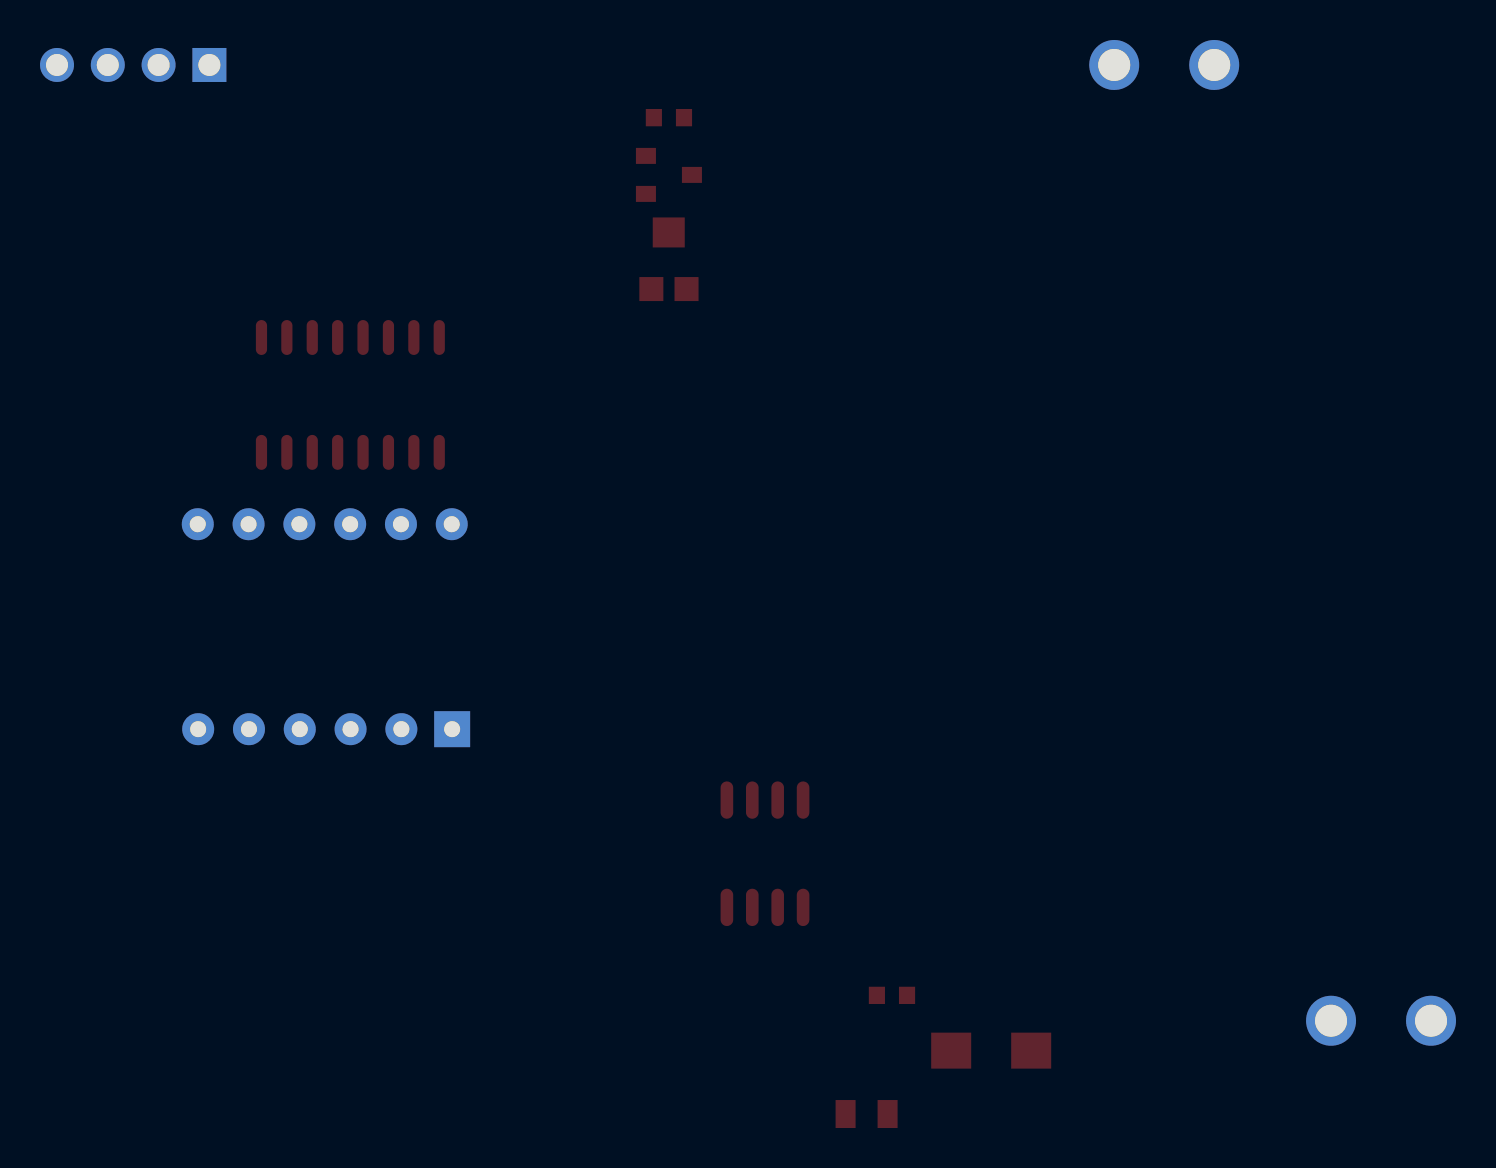
[diagram p7: board, bottom side, seen from below]

No outline. copper layers: Top Layer, Bottom Layer. Coordinates in mm from the lowest, leftmost part position.
Stack: Top Layer 0.035mm / Dielectric1 1.51mm FR4 er 4.5 / Bottom Layer 0.035mm

## Design rules (mm)
template: JLCPCB Capability(Two Layers Board)
spacing copperThickness1oz (default): track to track 0.102, other pairs 0.152 to 0.3
spacing copperThickness2oz: track to track 0.203, other pairs 0.152 to 0.3
track width copperThickness1oz (default): min 0.127, default 0.254, max 2.54
track width copperThickness2oz: min 0.203, default 0.254, max 2.54
differential pair differentialPair (default): width min 0.127, default 0.254, max 2.54; gap min 0.152, default 0.152
via viaSize (default): diameter min 0.5, default 0.61, max 10; hole min 0.3, default 0.305, max 6.3

## Placement (name value [footprint] x y rotation side)
H1  PZ254V-11-04P  [HDR-TH_4P-P2.54-V-M]  62.4 52.46 0 top
LED1_POWER1  NCD0805R1  [LED0805-R-RD]  25.73 0 0 top
Q1  AO3400  [SOT-23_L2.9-W1.3-P1.90-LS2.4-BR]  35.61 46.96 0 top
R1  1kΩ  [R0603]  24.46 5.93 0 top
R7  10kΩ  [R0603]  35.61 49.83 0 top
R8  2kΩ  [RES-ADJ-SMD_3P-L3.8-W3.6_TC33X-2-502E]  35.61 42.67 0 top
U1  PY32F002AL15S6TU  [SOP-8_L4.9-W3.9-P1.27-LS6.0-BL-1]  30.81 13.02 0 top
U2  MHDC3641SRBW  [LED-SEG-TH_12P-L30.0-W14.0-P2.54-LS10.2]  52.81 24.37 0 top
U3  TM1650  [SOP-16_L10.0-W3.9-P1.27-LS6.0-BL]  51.54 35.96 0 top
U4  DB126V-5.0-2P-GN-P  [CONN-TH_2P-P5.00_L7.8-W10.0]  0 4.66 0 top
U5  SMAJ3.3CA  [SMA_L4.4-W2.6-LS5.0-BI]  19.49 3.17 0 top
U6  DB126V-5.0-2P-GN-P  [CONN-TH_2P-P5.00_L7.8-W10.0]  10.84 52.46 0 top

## Footprints (pads in the part's own frame, mm; a bottom-side part is the same pattern mirrored in y, then rotated)
CONN-TH_2P-P5.00_L7.8-W10.0
  round 2.5 hole 1.6: 1(-2.5,0) 2(2.5,0)
HDR-TH_4P-P2.54-V-M
  rect 1.7x1.7 hole 1.1: 1(-3.81,0)
  round 1.7 hole 1.1: 2(-1.27,0) 3(1.27,0) 4(3.81,0)
LED0805-R-RD
  rect 1x1.399 smd: 1(1.05,0) 2(-1.05,0)
LED-SEG-TH_12P-L30.0-W14.0-P2.54-LS10.2
  rect 1.8x1.8 hole 0.8: 1(-6.36,-5.125)
  round 1.6 hole 0.8: 2(-3.82,-5.125) 3(-1.28,-5.125) 4(1.26,-5.125) 5(3.8,-5.125) 6(6.34,-5.125) 7(6.36,5.125) 8(3.82,5.125) 9(1.28,5.125) 10(-1.26,5.125) 11(-3.8,5.125) 12(-6.34,5.125)
R0603
  rect 0.806x0.864 smd: 1(-0.753,0) 2(0.753,0)
RES-ADJ-SMD_3P-L3.8-W3.6_TC33X-2-502E
  rect 1.2x1.2 smd: 1(-0.879,-1.415) 3(0.879,-1.415)
  rect 1.6x1.5 smd: 2(0.009,1.415)
SMA_L4.4-W2.6-LS5.0-BI
  rect 2x1.8 smd: 1(-2,0) 2(2,0)
SOP-8_L4.9-W3.9-P1.27-LS6.0-BL-1
  oval 0.63x1.865 smd: 1(-1.905,-2.683) 2(-0.635,-2.683) 3(0.635,-2.683) 4(1.905,-2.683) 5(1.905,2.683) 6(0.635,2.683) 7(-0.635,2.683) 8(-1.905,2.683)
SOP-16_L10.0-W3.9-P1.27-LS6.0-BL
  oval 0.56x1.745 smd: 1(-4.445,-2.873) 2(-3.175,-2.873) 3(-1.905,-2.873) 4(-0.635,-2.873) 5(0.635,-2.873) 6(1.905,-2.873) 7(3.175,-2.873) 8(4.445,-2.873) 9(4.445,2.873) 10(3.175,2.873) 11(1.905,2.873) 12(0.635,2.873) 13(-0.635,2.873) 14(-1.905,2.873) 15(-3.175,2.873) 16(-4.445,2.873)
SOT-23_L2.9-W1.3-P1.90-LS2.4-BR
  rect 1x0.8 smd: 1(1.15,-0.95) 2(1.15,0.95) 3(-1.15,0)

## Nets
As in the schematic, except:
IIC_SCL: U1.3
IIC_SDA: U1.2
$1N1912: Q1.3 R7.2
$1N1913: Q1.2 R8.3

Pads without a net: Q1 1

# Board PY32F002ATSSOP20V2
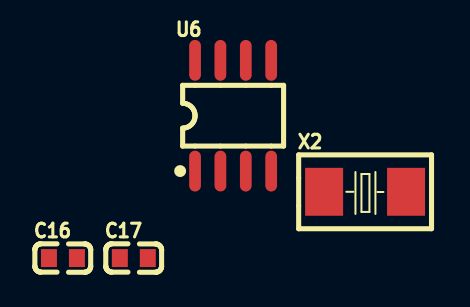
[diagram p8: board, top side]
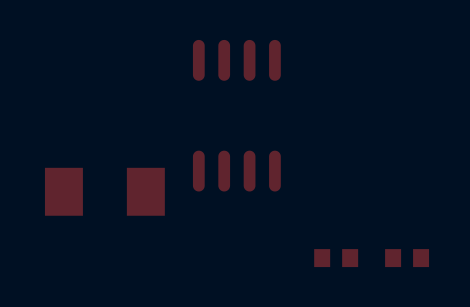
[diagram p9: board, bottom side, seen from below]

No outline. copper layers: Top Layer, Bottom Layer. Coordinates in mm from the lowest, leftmost part position.
Stack: Top Layer 0.035mm / Dielectric1 1.51mm FR4 er 4.5 / Bottom Layer 0.035mm

## Design rules (mm)
template: JLCPCB Capability(Two Layers Board)
spacing copperThickness1oz (default): track to track 0.102, other pairs 0.152 to 0.3
spacing copperThickness2oz: track to track 0.203, other pairs 0.152 to 0.3
track width copperThickness1oz (default): min 0.127, default 0.254, max 2.54
track width copperThickness2oz: min 0.203, default 0.254, max 2.54
differential pair differentialPair (default): width min 0.127, default 0.254, max 2.54; gap min 0.152, default 0.152
via viaSize (default): diameter min 0.5, default 0.61, max 10; hole min 0.3, default 0.305, max 6.3

## Placement (name value [footprint] x y rotation side)
C16  1uF  [C0603]  0 0 0 top
C17  10nF  [C0603]  3.55 0 0 top
U6  XL2400  [SOIC-8_L4.9-W3.9-P1.27-LS6.2-BL]  8.52 7.13 0 top
X2  16MHz  [OSC-SMD_L5.0-W3.2]  15.12 3.32 0 top

## Footprints (pads in the part's own frame, mm; a bottom-side part is the same pattern mirrored in y, then rotated)
C0603
  rect 0.8x0.9 smd: 1(-0.7,0) 2(0.7,0)
OSC-SMD_L5.0-W3.2
  rect 1.9x2.4 smd: 1(-2.05,0) 2(2.05,0)
SOIC-8_L4.9-W3.9-P1.27-LS6.2-BL
  oval 0.588x2.045 smd: 1(-1.905,-2.772) 2(-0.635,-2.772) 3(0.635,-2.772) 4(1.905,-2.772) 5(1.905,2.772) 6(0.635,2.772) 7(-0.635,2.772) 8(-1.905,2.772)

## Nets
3V3: C16.1 C17.1 U6.4
GND: C16.2 C17.2 U6.7
ANT: U6.8
$1N217: U6.6 X2.2
$1N221: U6.5 X2.1
$1N239: U6.1
$1N241: U6.2
$1N243: U6.3
